# Altium project VENTUNOQ.PrjPcb (part 14 of 18)

## Sheet HEADERS_JMEDIA_JMISC.SchDoc: JMEDIA JMISC
size A3; Author: Silvio Navaretti; CompanyName: ARDUINO; DrawnBy: Silvio Navaretti; Engineer: Silvio Navaretti; Organization: ARDUINO; SheetNumber: 21; SheetTotal: 51; RevAuthor: Silvio Navaretti
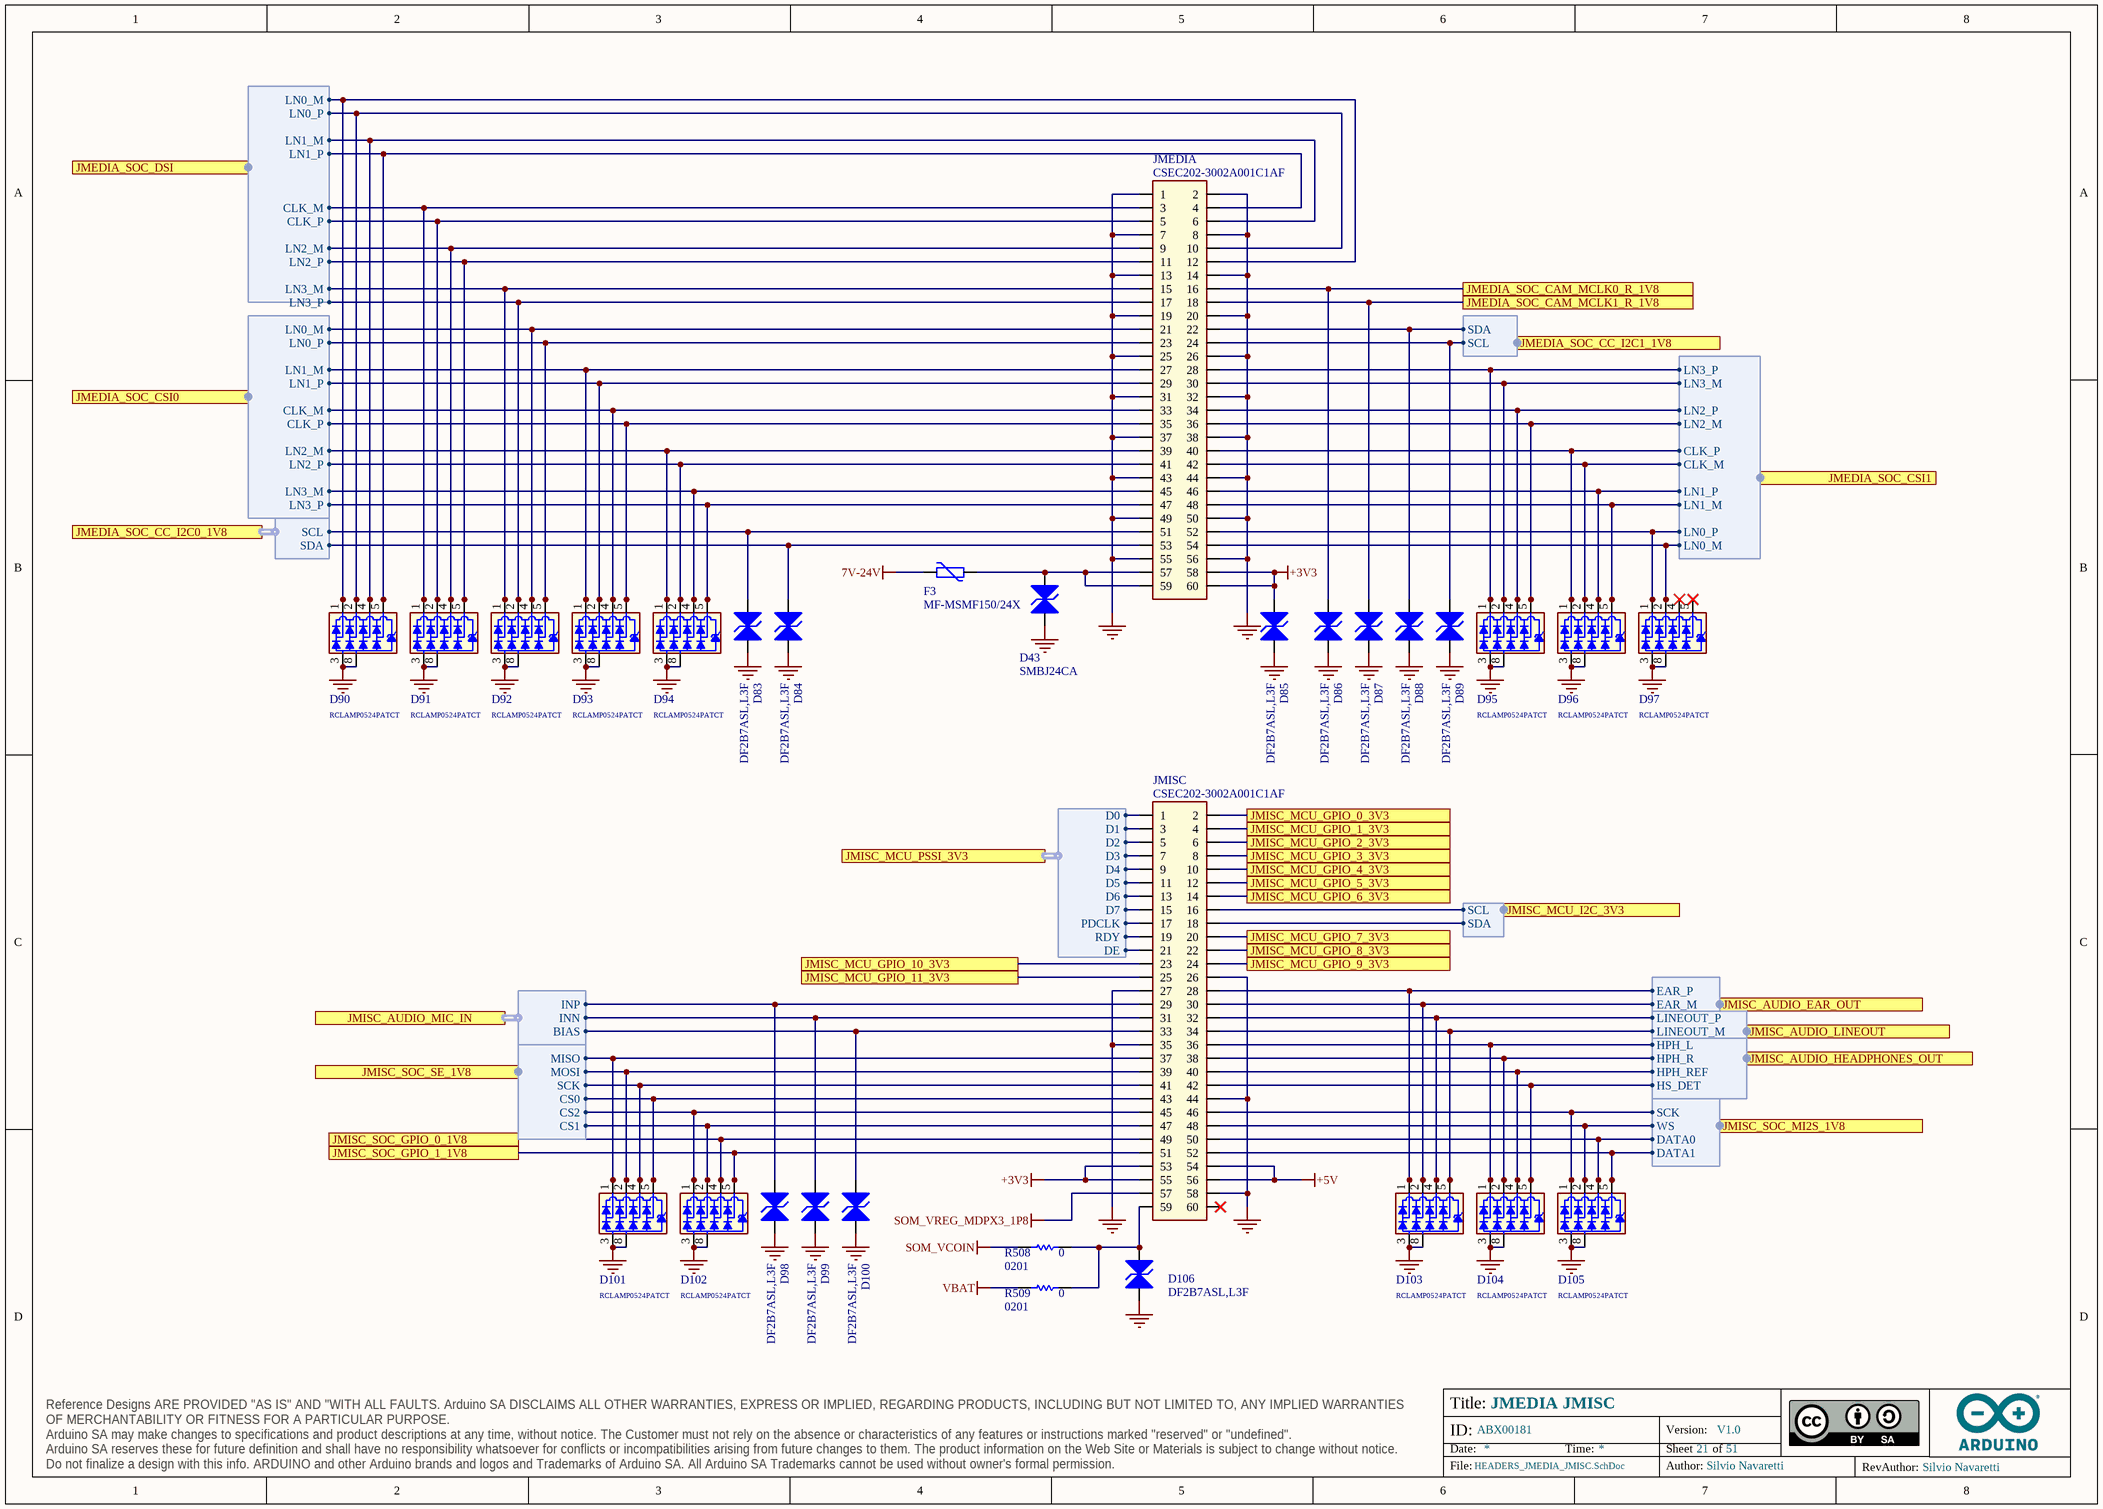
[diagram p43: HEADERS_JMEDIA_JMISC.SchDoc]

### Parts
D43  SMBJ24CA  [SMB_NOPOLARITY]
D83  DF2B7ASL,L3F  [DF2B7ASL,L3F]
D84  DF2B7ASL,L3F  [DF2B7ASL,L3F]
D85  DF2B7ASL,L3F  [DF2B7ASL,L3F]
D86  DF2B7ASL,L3F  [DF2B7ASL,L3F]
D87  DF2B7ASL,L3F  [DF2B7ASL,L3F]
D88  DF2B7ASL,L3F  [DF2B7ASL,L3F]
D89  DF2B7ASL,L3F  [DF2B7ASL,L3F]
D90  RCLAMP0524PATCT  [SLP2510P8]
D91  RCLAMP0524PATCT  [SLP2510P8]
D92  RCLAMP0524PATCT  [SLP2510P8]
D93  RCLAMP0524PATCT  [SLP2510P8]
D94  RCLAMP0524PATCT  [SLP2510P8]
D95  RCLAMP0524PATCT  [SLP2510P8]
D96  RCLAMP0524PATCT  [SLP2510P8]
D97  RCLAMP0524PATCT  [SLP2510P8]
D98  DF2B7ASL,L3F  [DF2B7ASL,L3F]
D99  DF2B7ASL,L3F  [DF2B7ASL,L3F]
D100  DF2B7ASL,L3F  [DF2B7ASL,L3F]
D101  RCLAMP0524PATCT  [SLP2510P8]
D102  RCLAMP0524PATCT  [SLP2510P8]
D103  RCLAMP0524PATCT  [SLP2510P8]
D104  RCLAMP0524PATCT  [SLP2510P8]
D105  RCLAMP0524PATCT  [SLP2510P8]
D106  DF2B7ASL,L3F  [DF2B7ASL,L3F]
F3  MF-MSMF150/24X  [1812]
JMEDIA  CSEC202-3002A001C1AF  [CSEC202-3002A001C1AF]
JMISC  CSEC202-3002A001C1AF  [CSEC202-3002A001C1AF]
R508  value 0  Case Code (Imperial): 0201  [RES-0201]  (hidden comment: CRCW02010000Z0ED)
R509  value 0  Case Code (Imperial): 0201  [RES-0201]  (hidden comment: CRCW02010000Z0ED)

### Ports
JMEDIA_SOC_CAM_MCLK0_R_1V8, JMEDIA_SOC_CAM_MCLK1_R_1V8, JMEDIA_SOC_CC_I2C0_1V8 (harness I2C), JMEDIA_SOC_CC_I2C1_1V8 (harness I2C), JMEDIA_SOC_CSI0 (harness MIPI_4LANES), JMEDIA_SOC_CSI1 (harness MIPI_4LANES), JMEDIA_SOC_DSI (harness MIPI_4LANES), JMISC_AUDIO_EAR_OUT (harness EAT), JMISC_AUDIO_HEADPHONES_OUT (harness HEADPHONES), JMISC_AUDIO_LINEOUT (harness LINEOUT), JMISC_AUDIO_MIC_IN (harness MIC), JMISC_MCU_GPIO_0_3V3, JMISC_MCU_GPIO_1_3V3, JMISC_MCU_GPIO_2_3V3, JMISC_MCU_GPIO_3_3V3, JMISC_MCU_GPIO_4_3V3, JMISC_MCU_GPIO_5_3V3, JMISC_MCU_GPIO_6_3V3, JMISC_MCU_GPIO_7_3V3, JMISC_MCU_GPIO_8_3V3, JMISC_MCU_GPIO_9_3V3, JMISC_MCU_GPIO_10_3V3, JMISC_MCU_GPIO_11_3V3, JMISC_MCU_I2C_3V3 (harness I2C), JMISC_MCU_PSSI_3V3 (harness PSSI), JMISC_SOC_GPIO_0_1V8, JMISC_SOC_GPIO_1_1V8, JMISC_SOC_MI2S_1V8 (harness SOM_MD_I2S), JMISC_SOC_SE_1V8 (harness SOM_MD_SPI_3CS)

### Harnesses
MIPI_4LANES: LN3_M, LN2_M, LN2_P, LN0_M, LN0_P, CLK_M, CLK_P, LN1_M, LN1_P, LN3_P
I2C: SDA, SCL
EAT: EAR_P, EAR_M
MIC: INP, INN, BIAS
LINEOUT: LINEOUT_P, LINEOUT_M
HEADPHONES: HPH_L, HPH_R, HPH_REF, HS_DET
SOM_MD_SPI_3CS: SCK, MISO, MOSI, CS0, CS1, CS2
SOM_MD_I2S: SCK, WS, DATA0, DATA1
PSSI: D0, D1, D2, D3, D4, D5, D6, D7, PDCLK, RDY, DE

### Nets
7V-24V: F3.1
+3V3: D85.2(A2) JMEDIA.58 JMEDIA.60 JMISC.53 JMISC.55
+5V: JMISC.54 JMISC.56
GND: D43.1(A1) D83.1(A1) D84.1(A1) D85.1(A1) D86.1(A1) D87.1(A1) D88.1(A1) D89.1(A1) D90.3 D90.8 D91.3 D91.8 D92.3 D92.8 D93.3 D93.8 D94.3 D94.8 D95.3 D95.8 D96.3 D96.8 D97.3 D97.8 D98.1(A1) D99.1(A1) D100.1(A1) D101.3 D101.8 D102.3 D102.8 D103.3 D103.8 D104.3 D104.8 D105.3 D105.8 D106.1(A1) JMEDIA.1 JMEDIA.2 JMEDIA.7 JMEDIA.8 JMEDIA.13 JMEDIA.14 JMEDIA.19 JMEDIA.20 JMEDIA.25 JMEDIA.26 JMEDIA.31 JMEDIA.32 JMEDIA.37 JMEDIA.38 JMEDIA.43 JMEDIA.44 JMEDIA.49 JMEDIA.50 JMEDIA.55 JMEDIA.56 JMISC.26 JMISC.27 JMISC.35 JMISC.44 JMISC.58
SOM_VCOIN: R508.2
SOM_VREG_MDPX3_1P8: JMISC.57
VBAT: R509.2
A_CLK_N: D91.1 D91.10 JMEDIA.3 ; port JMEDIA_SOC_DSI.CLK_M
A_CLK_N: D93.4 D93.7 JMEDIA.33 ; port JMEDIA_SOC_CSI0.CLK_M  [a separate net that carries the same name]
A_CLK_N: D96.2 D96.9 JMEDIA.42 ; port JMEDIA_SOC_CSI1.CLK_M  [a separate net that carries the same name]
A_CLK_P: D91.2 D91.9 JMEDIA.5 ; port JMEDIA_SOC_DSI.CLK_P
A_CLK_P: D93.5 D93.6 JMEDIA.35 ; port JMEDIA_SOC_CSI0.CLK_P  [a separate net that carries the same name]
A_CLK_P: D96.1 D96.10 JMEDIA.40 ; port JMEDIA_SOC_CSI1.CLK_P  [a separate net that carries the same name]
A_LN0_N: D90.1 D90.10 JMEDIA.12 ; port JMEDIA_SOC_DSI.LN0_M
A_LN0_N: D92.4 D92.7 JMEDIA.21 ; port JMEDIA_SOC_CSI0.LN0_M  [a separate net that carries the same name]
A_LN0_N: D97.2 D97.9 JMEDIA.54 ; port JMEDIA_SOC_CSI1.LN0_M  [a separate net that carries the same name]
A_LN0_P: D90.2 D90.9 JMEDIA.10 ; port JMEDIA_SOC_DSI.LN0_P
A_LN0_P: D92.5 D92.6 JMEDIA.23 ; port JMEDIA_SOC_CSI0.LN0_P  [a separate net that carries the same name]
A_LN0_P: D97.1 D97.10 JMEDIA.52 ; port JMEDIA_SOC_CSI1.LN0_P  [a separate net that carries the same name]
A_LN1_N: D90.4 D90.7 JMEDIA.6 ; port JMEDIA_SOC_DSI.LN1_M
A_LN1_N: D93.1 D93.10 JMEDIA.27 ; port JMEDIA_SOC_CSI0.LN1_M  [a separate net that carries the same name]
A_LN1_N: D96.5 D96.6 JMEDIA.48 ; port JMEDIA_SOC_CSI1.LN1_M  [a separate net that carries the same name]
A_LN1_P: D90.5 D90.6 JMEDIA.4 ; port JMEDIA_SOC_DSI.LN1_P
A_LN1_P: D93.2 D93.9 JMEDIA.29 ; port JMEDIA_SOC_CSI0.LN1_P  [a separate net that carries the same name]
A_LN1_P: D96.4 D96.7 JMEDIA.46 ; port JMEDIA_SOC_CSI1.LN1_P  [a separate net that carries the same name]
A_LN2_N: D91.4 D91.7 JMEDIA.9 ; port JMEDIA_SOC_DSI.LN2_M
A_LN2_N: D94.1 D94.10 JMEDIA.39 ; port JMEDIA_SOC_CSI0.LN2_M  [a separate net that carries the same name]
A_LN2_N: D95.5 D95.6 JMEDIA.36 ; port JMEDIA_SOC_CSI1.LN2_M  [a separate net that carries the same name]
A_LN2_P: D91.5 D91.6 JMEDIA.11 ; port JMEDIA_SOC_DSI.LN2_P
A_LN2_P: D94.2 D94.9 JMEDIA.41 ; port JMEDIA_SOC_CSI0.LN2_P  [a separate net that carries the same name]
A_LN2_P: D95.4 D95.7 JMEDIA.34 ; port JMEDIA_SOC_CSI1.LN2_P  [a separate net that carries the same name]
A_LN3_N: D92.1 D92.10 JMEDIA.15 ; port JMEDIA_SOC_DSI.LN3_M
A_LN3_N: D94.4 D94.7 JMEDIA.45 ; port JMEDIA_SOC_CSI0.LN3_M  [a separate net that carries the same name]
A_LN3_N: D95.2 D95.9 JMEDIA.30 ; port JMEDIA_SOC_CSI1.LN3_M  [a separate net that carries the same name]
A_LN3_P: D92.2 D92.9 JMEDIA.17 ; port JMEDIA_SOC_DSI.LN3_P
A_LN3_P: D94.5 D94.6 JMEDIA.47 ; port JMEDIA_SOC_CSI0.LN3_P  [a separate net that carries the same name]
A_LN3_P: D95.1 D95.10 JMEDIA.28 ; port JMEDIA_SOC_CSI1.LN3_P  [a separate net that carries the same name]
MD_CCI_I2C0.SCL: D83.2(A2) JMEDIA.51 ; port JMEDIA_SOC_CC_I2C0_1V8.SCL
MD_CCI_I2C0.SDA: D84.2(A2) JMEDIA.53 ; port JMEDIA_SOC_CC_I2C0_1V8.SDA
MD_CCI_I2C2.SCL: D89.2(A2) JMEDIA.24 ; port JMEDIA_SOC_CC_I2C1_1V8.SCL
MD_CCI_I2C2.SDA: D88.2(A2) JMEDIA.22 ; port JMEDIA_SOC_CC_I2C1_1V8.SDA
MD_GPIO_10: D101.1 D101.10 JMISC.37 ; port JMISC_SOC_SE_1V8.MISO
MD_GPIO_11: D101.2 D101.9 JMISC.39 ; port JMISC_SOC_SE_1V8.MOSI
MD_GPIO_12: D101.4 D101.7 JMISC.41 ; port JMISC_SOC_SE_1V8.SCK
MD_GPIO_13: D101.5 D101.6 JMISC.43 ; port JMISC_SOC_SE_1V8.CS0
MD_GPIO_14: D102.2 D102.9 JMISC.47 ; port JMISC_SOC_SE_1V8.CS1
MD_GPIO_15: D102.1 D102.10 JMISC.45 ; port JMISC_SOC_SE_1V8.CS2
MD_GPIO_67: D86.2(A2) JMEDIA.16 ; port JMEDIA_SOC_CAM_MCLK0_R_1V8
MD_GPIO_68: D87.2(A2) JMEDIA.18 ; port JMEDIA_SOC_CAM_MCLK1_R_1V8
MD_GPIO_73: D102.4 D102.7 JMISC.49 ; port JMISC_SOC_GPIO_0_1V8
MD_GPIO_74: D102.5 D102.6 JMISC.51 ; port JMISC_SOC_GPIO_1_1V8
MD_LPASS_GPIO_120: D105.1 D105.10 JMISC.46 ; port JMISC_SOC_MI2S_1V8.SCK
MD_LPASS_GPIO_121: D105.2 D105.9 JMISC.48 ; port JMISC_SOC_MI2S_1V8.WS
MD_LPASS_GPIO_122: D105.4 D105.7 JMISC.50 ; port JMISC_SOC_MI2S_1V8.DATA0
MD_LPASS_GPIO_123: D105.5 D105.6 JMISC.52 ; port JMISC_SOC_MI2S_1V8.DATA1
MIC_IN5_IN6.BIAS: D100.2(A2) JMISC.33 ; port JMISC_AUDIO_MIC_IN.BIAS
PA0: JMISC.20 ; port JMISC_MCU_GPIO_7_3V3
PA1: JMISC.22 ; port JMISC_MCU_GPIO_8_3V3
PA2: JMISC.24 ; port JMISC_MCU_GPIO_9_3V3
PA6: JMISC.17 ; port JMISC_MCU_PSSI_3V3.PDCLK
PA9: JMISC.1 ; port JMISC_MCU_PSSI_3V3.D0
PA11: JMISC.23 ; port JMISC_MCU_GPIO_10_3V3
PA12: JMISC.25 ; port JMISC_MCU_GPIO_11_3V3
PC7: JMISC.3 ; port JMISC_MCU_PSSI_3V3.D1
PC8: JMISC.5 ; port JMISC_MCU_PSSI_3V3.D2
PC11: JMISC.9 ; port JMISC_MCU_PSSI_3V3.D4
PD3: JMISC.11 ; port JMISC_MCU_PSSI_3V3.D5
PE1: JMISC.7 ; port JMISC_MCU_PSSI_3V3.D3
PE2: JMISC.2 ; port JMISC_MCU_GPIO_0_3V3
PE3: JMISC.4 ; port JMISC_MCU_GPIO_1_3V3
PE4: JMISC.6 ; port JMISC_MCU_GPIO_2_3V3
PE5: JMISC.8 ; port JMISC_MCU_GPIO_3_3V3
PE6: JMISC.10 ; port JMISC_MCU_GPIO_4_3V3
PE7: JMISC.12 ; port JMISC_MCU_GPIO_5_3V3
PE8: JMISC.14 ; port JMISC_MCU_GPIO_6_3V3
PF0: JMISC.18 ; port JMISC_MCU_I2C_3V3.SDA
PF1: JMISC.16 ; port JMISC_MCU_I2C_3V3.SCL
PF4: JMISC.13 ; port JMISC_MCU_PSSI_3V3.D6
PH8: JMISC.21 ; port JMISC_MCU_PSSI_3V3.DE
PI5: JMISC.19 ; port JMISC_MCU_PSSI_3V3.RDY
PI7: JMISC.15 ; port JMISC_MCU_PSSI_3V3.D7
NetC209_2: D98.2(A2) JMISC.29 ; port JMISC_AUDIO_MIC_IN.INP
NetC217_2: D99.2(A2) JMISC.31 ; port JMISC_AUDIO_MIC_IN.INN
NetC248_2: D104.1 D104.10 JMISC.36 ; port JMISC_AUDIO_HEADPHONES_OUT.HPH_L
NetC295_2: D104.2 D104.9 JMISC.38 ; port JMISC_AUDIO_HEADPHONES_OUT.HPH_R
NetD43_2: D43.2(A2) F3.2 JMEDIA.57 JMEDIA.59
NetD97_4: D97.4 D97.7
NetD97_5: D97.5 D97.6
NetD103_1: D103.1 D103.10 JMISC.28 ; port JMISC_AUDIO_EAR_OUT.EAR_P
NetD103_2: D103.2 D103.9 JMISC.30 ; port JMISC_AUDIO_EAR_OUT.EAR_M
NetD103_4: D103.4 D103.7 JMISC.32 ; port JMISC_AUDIO_LINEOUT.LINEOUT_P
NetD103_5: D103.5 D103.6 JMISC.34 ; port JMISC_AUDIO_LINEOUT.LINEOUT_M
NetD104_4: D104.4 D104.7 JMISC.40 ; port JMISC_AUDIO_HEADPHONES_OUT.HPH_REF
NetD104_5: D104.5 D104.6 JMISC.42 ; port JMISC_AUDIO_HEADPHONES_OUT.HS_DET
NetD106_2: D106.2(A2) JMISC.59 R508.1 R509.1

Not connected (* = marked no-connect by the designer): JMISC 60*

### Notes on the sheet
- Title:
- ID:
- Date:
- Time:
- Version:
- Sheet
- of
- RevAuthor:
- Reference Designs ARE PROVIDED "AS IS" AND "WITH ALL FAULTS. Arduino SA DISCLAIMS ALL OTHER WARRANTIES, EXPRESS OR IMPLIED, REGARDING PRODUCTS, INCLUDING BUT NOT LIMITED TO, ANY IMPLIED WARRANTIES OF MERCHANTABILITY OR FITNESS FOR A PARTICULAR PURPOSE.
  Arduino SA may make changes to specifications and product descriptions at any time, without notice. The Customer must not rely on the absence or characteristics of any features or instructions marked "reserved" or "undefined".
  Arduino SA reserves these for future definition and shall have no responsibility whatsoever for conflicts or incompatibilities arising from future changes to them. The product information on the Web Site or Materials is subject to change without notice.
  Do not finalize a design with this info. ARDUINO and other Arduino brands and logos and Trademarks of Arduino SA. All Arduino SA Trademarks cannot be used without owner's formal permission.
- File:
- Author:

### Library data of the parts
D43 = D0070-A.2: TVS BIDIRECTIONAL SMD Vr 24V, Vbr min 26.7V, 600W, SMB; Manufacturer: Littlefuse; V(BR) Typ (V): 26.7; Code Arduino: D0070; Manufacturer 2: Bourns; Part Number: SMBJ24CA; Manufacturer 3: Hottech
D83-D89 D98-D100 D106 = D0099-5: TVS BIDIRECTIONAL SMD Vr 5.5V, Vbr min 5.8V, 0.62x0.32mm; Manufacturer: TOSHIBA; Vforward max: 0V; Ireverse max: 1µA; Power max: 80W; Code Arduino: D0099; Vreverse max: 20V; V(BR) min: 5.8V; V(RWM) max: 5.5V; Part Number: DF2B7ASL,L3F
D90-D97 D101-D105 = D0097-A.6: TVS UNIDIRECTIONAL 4CH 0.8pF 5V SLP2510P8 10-pin 2.5x1.0x0.58mm; Manufacturer: SEMTECH; Code Arduino: D0097; Device Type: ESD protection; Part Number: RCLAMP0524PATCT
F3 = P0019-A.1: PTC Ihold 1.5A Itrip 3A 24V 1812; Manufacturer: Bourns; Code Arduino: P0019; Part Number: MF-MSMF150/24X
JMEDIA JMISC = J0565-A.3: CONN HEADER FEMALE VERTICAL SMD 1.27mm 2x30 POS heigth 4.4mm; Manufacturer: Greenconn; Code Arduino: J0565; Part Number: CSEC202-3002A001C1AF
R508 R509 = R0140-A.21: RES CHIP 0201 0R; Manufacturer: Vishay; Temperature coefficient: 0ppm; Code Arduino: R0140; Power: 50mW; Tolerance: 0%; Technology: Thick film; Part Number: CRCW02010000Z0ED

## Sheet HEADERS_JCTL.SchDoc: JCTL
size A3; Author: Silvio Navaretti; CompanyName: ARDUINO; DrawnBy: Silvio Navaretti; Engineer: Silvio Navaretti; Organization: ARDUINO; SheetNumber: 23; SheetTotal: 51; RevAuthor: Silvio Navaretti
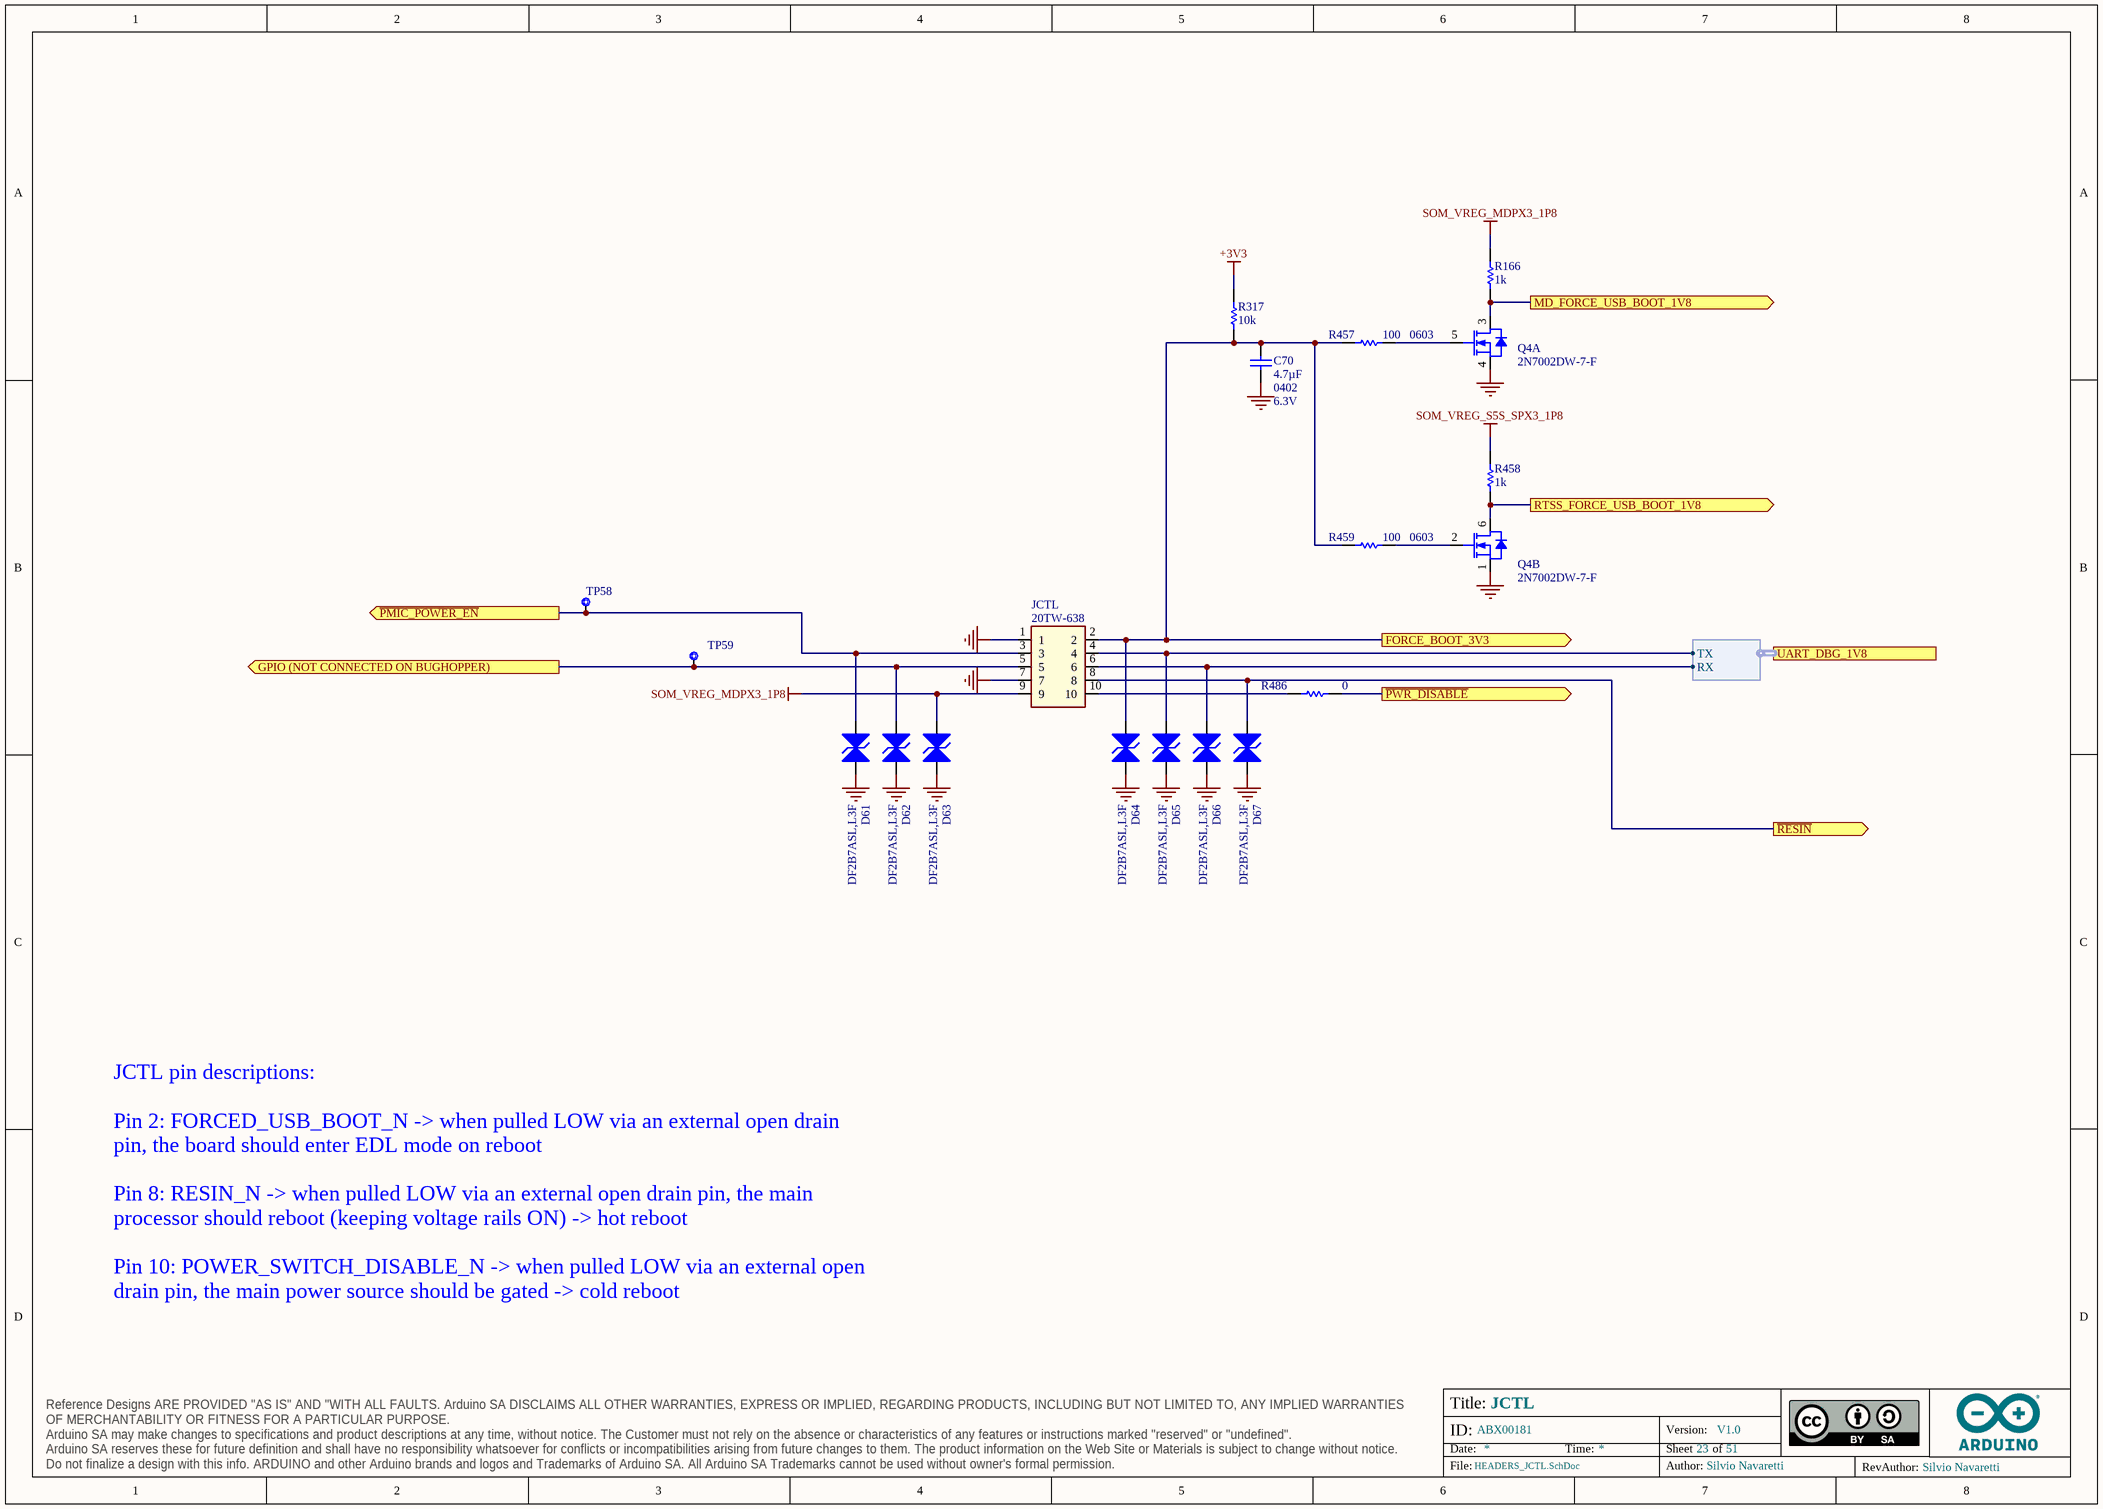
[diagram p44: HEADERS_JCTL.SchDoc]

### Parts
C70  value 4.7µF  Case Code (Imperial): 0402  Voltage: 6.3V  [CAP-0402]  (hidden comment: C1005A475M6R3NT)
D61  DF2B7ASL,L3F  [DF2B7ASL,L3F]
D62  DF2B7ASL,L3F  [DF2B7ASL,L3F]
D63  DF2B7ASL,L3F  [DF2B7ASL,L3F]
D64  DF2B7ASL,L3F  [DF2B7ASL,L3F]
D65  DF2B7ASL,L3F  [DF2B7ASL,L3F]
D66  DF2B7ASL,L3F  [DF2B7ASL,L3F]
D67  DF2B7ASL,L3F  [DF2B7ASL,L3F]
JCTL  20TW-638  [20TW-638]
Q4  2N7002DW-7-F  [SOT363]  (parts A,B of 2)
R166  value 1k  [RES-0201]  (hidden comment: RC0201FR-071KL)
R317  value 10k  [RES-0201]  (hidden comment: RC0201FR-0710KL)
R457  value 100  Case Code (Imperial): 0603  [RES-0603]  (hidden comment: CRCW0603100RFKEAC)
R458  value 1k  [RES-0201]  (hidden comment: RC0201FR-071KL)
R459  value 100  Case Code (Imperial): 0603  [RES-0603]  (hidden comment: CRCW0603100RFKEAC)
R486  value 0  [RES-0201]  (hidden comment: CRCW02010000Z0ED)
TP58  Test point 1.00mm  [TP-1.00MM]  (value not drawn)  (no BOM)
TP59  Test point 1.00mm  [TP-1.00MM]  (value not drawn)  (no BOM)

### Ports
FORCE_BOOT_3V3 (out), GPIO (NOT CONNECTED ON BUGHOPPER) (out), MD_FORCE_USB_BOOT_1V8 (out), RTSS_FORCE_USB_BOOT_1V8 (out), UART_DBG_1V8 (harness UART), ~{PMIC_POWER_EN} (out), ~{PWR_DISABLE} (out), ~{RESIN} (out)

### Harnesses
UART: TX, RX

### Nets
+3V3: R317.2
GND: C70.2 D61.1(A1) D62.1(A1) D63.1(A1) D64.1(A1) D65.1(A1) D66.1(A1) D67.1(A1) JCTL.1 JCTL.7 Q4.1(S) Q4.4(S)
SOM_VREG_MDPX3_1P8: D63.2(A2) JCTL.9 R166.1
SOM_VREG_S5S_SPX3_1P8: R458.1
FORCE_BOOT_3V3: C70.1 D64.2(A2) JCTL.2 R317.1 R457.2 R459.2 ; port FORCE_BOOT_3V3
MD_GPIO_43: D65.2(A2) JCTL.4 ; port UART_DBG_1V8.TX
MD_GPIO_44: D66.2(A2) JCTL.6 ; port UART_DBG_1V8.RX
~{PM_RESIN_N_3V3}: D67.2(A2) JCTL.8 ; port ~{RESIN}
~{POWER_DISABLE_7-24V}: R486.1 ; port ~{PWR_DISABLE}
NetD61_2: D61.2(A2) JCTL.3 TP58.X ; port ~{PMIC_POWER_EN}
NetD62_2: D62.2(A2) JCTL.5 TP59.X ; port GPIO (NOT CONNECTED ON BUGHOPPER)
NetJCTL_10: JCTL.10 R486.2
NetQ4_2: Q4.2(G) R459.1
NetQ4_3: Q4.3(D) R166.2 ; port MD_FORCE_USB_BOOT_1V8
NetQ4_5: Q4.5(G) R457.1
NetQ4_6: Q4.6(D) R458.2 ; port RTSS_FORCE_USB_BOOT_1V8

### Notes on the sheet
- JCTL pin descriptions:
  Pin 2: FORCED_USB_BOOT_N -> when pulled LOW via an external open drain pin, the board should enter EDL mode on reboot
  Pin 8: RESIN_N -> when pulled LOW via an external open drain pin, the main processor should reboot (keeping voltage rails ON) -> hot reboot
  Pin 10: POWER_SWITCH_DISABLE_N -> when pulled LOW via an external open drain pin, the main power source should be gated -> cold reboot
- Title:
- ID:
- Date:
- Time:
- Version:
- Sheet
- of
- RevAuthor:
- Reference Designs ARE PROVIDED "AS IS" AND "WITH ALL FAULTS. Arduino SA DISCLAIMS ALL OTHER WARRANTIES, EXPRESS OR IMPLIED, REGARDING PRODUCTS, INCLUDING BUT NOT LIMITED TO, ANY IMPLIED WARRANTIES OF MERCHANTABILITY OR FITNESS FOR A PARTICULAR PURPOSE.
  Arduino SA may make changes to specifications and product descriptions at any time, without notice. The Customer must not rely on the absence or characteristics of any features or instructions marked "reserved" or "undefined".
  Arduino SA reserves these for future definition and shall have no responsibility whatsoever for conflicts or incompatibilities arising from future changes to them. The product information on the Web Site or Materials is subject to change without notice.
  Do not finalize a design with this info. ARDUINO and other Arduino brands and logos and Trademarks of Arduino SA. All Arduino SA Trademarks cannot be used without owner's formal permission.
- File:
- Author:

### Library data of the parts
C70 = C0037-A.14: CAP CHIP 0402 4.7uF 20% 6V3 X5R; Manufacturer: Hottech; Code Arduino: 0833; Dielectric: X5R; Technology: Ceramic; Part Number: C1005A475M6R3NT; Manufacturer 2: Samsung Electro-Mechanics; Tolerance: 20%; Manufacturer 3: Murata Electronics; Part number 3: GRM155R60J475ME47D; Part number 2: CL05A475KQ5NRNC
D61-D67 = D0099-5: as D83-D89 on sheet HEADERS_JMEDIA_JMISC; V(BR) min: 5.8V; V(RWM) max: 5.5V; Part Number: DF2B7ASL,L3F
JCTL = J0570-A.1: CONN HEADER MALE 10POS 2x5 2.54mm SMD; Manufacturer: 4UCONN; Number of Contacts: 10; Connector Type: BOARD CONNECTOR; Code Arduino: J0570; Contact Material: Gold; Part Number: 20TW-638; Termination: SMD/SMT; Insulation Color: Black
Q4 = T0011-A.12: MOSFET 2N-CH 60V 0.32A SOT363; Manufacturer: Diodes Inc.; Device Type: Mosfet 2N-CH SMD; Code Arduino: A5500; Manufacturer 2: Nexperia; Manufacturer Part Number 2: 2N7002PS,115; Pin Count: 6; Part Number: 2N7002DW-7-F
R166 R458 = R0195-A.22: RES CHIP 0201 1k 1% 1/20W; Manufacturer: Yageo; Power: 50mW; Temperature coefficient: 200ppm; Code Arduino: R0195; Tolerance: 1%; Case Code (Imperial): 0201; Part Number: RC0201FR-071KL; Technology: Thick film
R317 = R0145-A.21: RES CHIP 0201 10k 1% 1/20W; Manufacturer: Yageo; Power: 50mW; Temperature coefficient: 200ppm; Code Arduino: R0145; Manufacturer 2: Samsung Electro-Mechanics; Tolerance: 1%; Case Code (Imperial): 0201; Part Number: RC0201FR-0710KL; Technology: Thick film
R457 R459 = R0105-A.22: RES CHIP 0603 100R 1% 1/10W; Manufacturer: Vishay; Power: 100mW; Temperature coefficient: 100ppm; Code Arduino: A5099; Part Number: CRCW0603100RFKEAC; Tolerance: 1%; Technology: Thick film
R486 = R0140-A.21: as R508 on sheet HEADERS_JMEDIA_JMISC; Technology: Thick film; Case Code (Imperial): 0201; Part Number: CRCW02010000Z0ED
TP58 TP59 = UT0013-A.6: Part Number: This is not a component; Design Item ID: CMP-018-0005-A.3; Source: ut.SchLib; Manufacturer: This is not a component; Code Arduino: This is not a component; Pin Count: 1

## Sheet HEATSINK_FAN.SchDoc: HEATSINK FAN
size A3; Author: Silvio Navaretti; CompanyName: ARDUINO; DrawnBy: Silvio Navaretti; Engineer: Silvio Navaretti; Organization: ARDUINO; SheetNumber: 50; SheetTotal: 51; RevAuthor: Silvio Navaretti
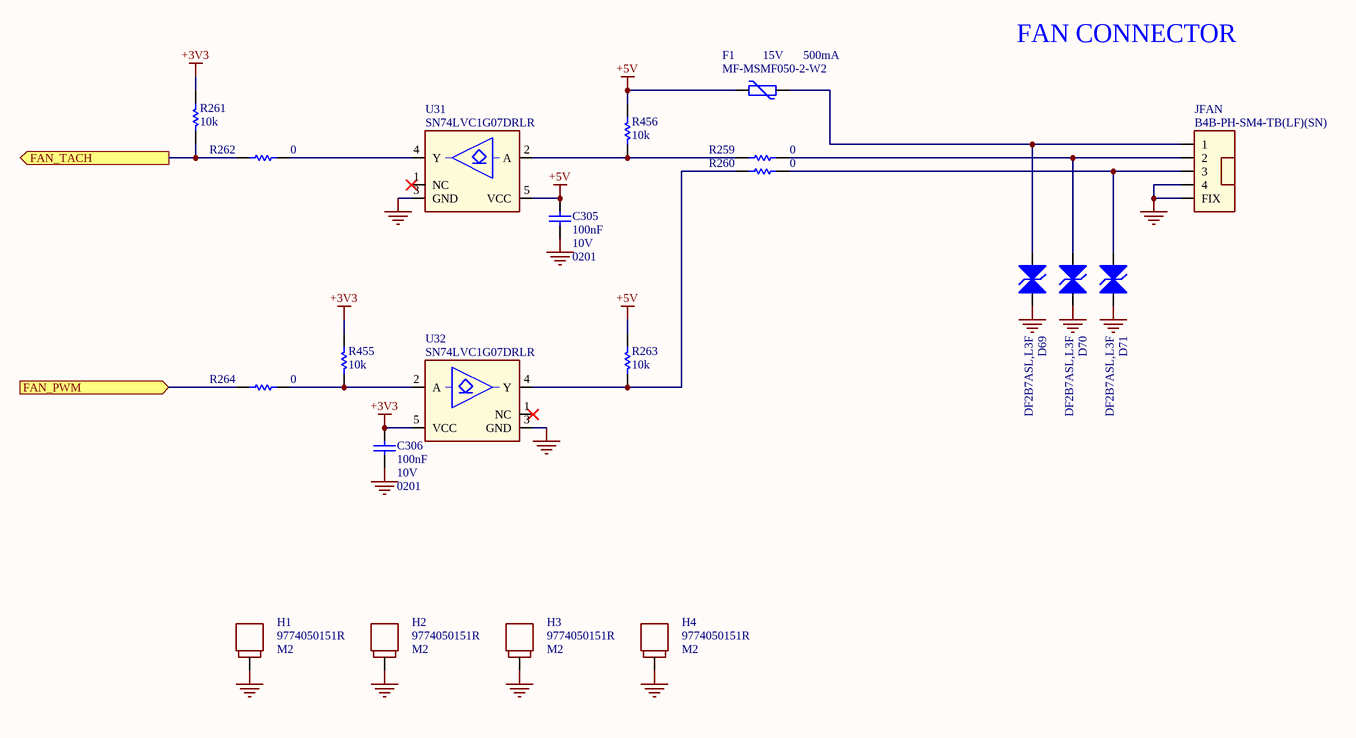
[diagram p45: HEATSINK_FAN.SchDoc]

### Parts
C305  value 100nF  Voltage: 10V  Case Code (Imperial): 0201  [CAP-0201]  (hidden comment: CL03A104KP3NNNC)
C306  value 100nF  Voltage: 10V  Case Code (Imperial): 0201  [CAP-0201]  (hidden comment: CL03A104KP3NNNC)
D69  DF2B7ASL,L3F  [DF2B7ASL,L3F]
D70  DF2B7ASL,L3F  [DF2B7ASL,L3F]
D71  DF2B7ASL,L3F  [DF2B7ASL,L3F]
F1  MF-MSMF050-2-W2  Hold Current: 500mA  Operating Supply Voltage: 15V  [1812]
H1  9774050151R  [9774050151R]
H2  9774050151R  [9774050151R]
H3  9774050151R  [9774050151R]
H4  9774050151R  [9774050151R]
JFAN  B4B-PH-SM4-TB(LF)(SN)  [B4B-PH-SM4-TB(LF)(SN)]
R259  value 0  [RES-0201]  (hidden comment: CRCW02010000Z0ED)
R260  value 0  [RES-0201]  (hidden comment: CRCW02010000Z0ED)
R261  value 10k  [RES-0201]  (hidden comment: RC0201FR-0710KL)
R262  value 0  [RES-0201]  (hidden comment: CRCW02010000Z0ED)
R263  value 10k  [RES-0201]  (hidden comment: RC0201FR-0710KL)
R264  value 0  [RES-0201]  (hidden comment: CRCW02010000Z0ED)
R455  value 10k  [RES-0201]  (hidden comment: RC0201FR-0710KL)
R456  value 10k  [RES-0201]  (hidden comment: RC0201FR-0710KL)
U31  SN74LVC1G07DRLR  [TI DRL DRL0005A]
U32  SN74LVC1G07DRLR  [TI DRL DRL0005A]

### Ports
FAN_PWM (in), FAN_TACH (out)

### Nets
+3V3: C306.2 R261.2 R455.2 U32.5(VCC)
+5V: C305.2 F1.1 R263.2 R456.2 U31.5(VCC)
GND: C305.1 C306.1 D69.1(A1) D70.1(A1) D71.1(A1) H1.1 H2.1 H3.1 H4.1 JFAN.4 JFAN.FIX U31.3(GND) U32.3(GND)
PA7: R261.1 R262.2 ; port FAN_TACH
PG15: R264.2 ; port FAN_PWM
NetD69_2: D69.2(A2) F1.2 JFAN.1
NetD70_2: D70.2(A2) JFAN.2 R259.1
NetD71_2: D71.2(A2) JFAN.3 R260.1
NetR259_2: R259.2 R456.1 U31.2(A)
NetR260_2: R260.2 R263.1 U32.4(Y)
NetR262_1: R262.1 U31.4(Y)
NetR264_1: R264.1 R455.1 U32.2(A)

Not connected (* = marked no-connect by the designer): U31 1(NC)*; U32 1(NC)*

### Notes on the sheet
- FAN CONNECTOR
- Title:
- ID:
- Date:
- Time:
- Version:
- Sheet
- of
- RevAuthor:
- Reference Designs ARE PROVIDED "AS IS" AND "WITH ALL FAULTS. Arduino SA DISCLAIMS ALL OTHER WARRANTIES, EXPRESS OR IMPLIED, REGARDING PRODUCTS, INCLUDING BUT NOT LIMITED TO, ANY IMPLIED WARRANTIES OF MERCHANTABILITY OR FITNESS FOR A PARTICULAR PURPOSE.
  Arduino SA may make changes to specifications and product descriptions at any time, without notice. The Customer must not rely on the absence or characteristics of any features or instructions marked "reserved" or "undefined".
  Arduino SA reserves these for future definition and shall have no responsibility whatsoever for conflicts or incompatibilities arising from future changes to them. The product information on the Web Site or Materials is subject to change without notice.
  Do not finalize a design with this info. ARDUINO and other Arduino brands and logos and Trademarks of Arduino SA. All Arduino SA Trademarks cannot be used without owner's formal permission.
- File:
- Author:
- (in symbol S0005-A.6) M2

### Library data of the parts
C305 C306 = C0113-A.6: CAP CHIP 0201 100nF 10% 10V X5R; Manufacturer: Samsung Electro-Mechanics; Code Arduino: C0113; Technology: Ceramic; Part Number: CL03A104KP3NNNC; Dielectric: X5R; Tolerance: 10%
D69-D71 = D0099-5: as D83-D89 on sheet HEADERS_JMEDIA_JMISC; V(BR) min: 5.8V; V(RWM) max: 5.5V; Part Number: DF2B7ASL,L3F
F1 = P0002-A.7: PTC RESET FUSE 15V 500MA 1812 LOGO OO ARDUINO; Manufacturer: Bourns; Approvals: UL,CSA,TUV; Time to Trip: 0.15s; Max Current Rating: 100A; Trip Current: 1A; Resistance: 150mR; Code Arduino: 3335; Power Dissipation: 800mW; Part Number: MF-MSMF050-2-W2; Contact Plating: Gold; Case Code (Metric): 4532; Min Operating Temperature: -40°C; Packaging: Tape and Reel; Max Operating Temperature: 85°C; Radiation Hardening: No; Voltage Rating (DC): 15V; Termination: SMD/SMT; Number of Terminals: 2; Terminal Material: Gold; Voltage Rating: 15V; Width: 3.41mm; Case Code (Imperial): 1812; Length: 4.73mm; Current Rating: 100A; REACH SVHC: No SVHC; Package Quantity: 2000; Lead Free: Lead Free; Case/Package: 1812; Height: 0.85mm; Mount: Surface Mount,PCB
H1-H4 = S0005-A.6: M2.5 SPACER SMT ROUND STEEL H=5mm; Manufacturer: Würth Elektronik; Code Arduino: S0005; Part Number: 9774050151R
JFAN = J0557-A.2: CONN Header SMD 1x4 vertical polarized; Manufacturer: JST; Code Arduino: J0557; Part Number: B4B-PH-SM4-TB(LF)(SN)
R259 R260 R262 R264 = R0140-A.21: as R508 on sheet HEADERS_JMEDIA_JMISC; Technology: Thick film; Case Code (Imperial): 0201; Part Number: CRCW02010000Z0ED
R261 R263 R455 R456 = R0145-A.21: as R317 on sheet HEADERS_JCTL; Manufacturer 2: Samsung Electro-Mechanics; Tolerance: 1%; Case Code (Imperial): 0201; Part Number: RC0201FR-0710KL; Technology: Thick film
U31 U32 = U0494-A.2: IC buffer open drain, 1.65V to 5.5V, 32mA sink current, SOT-5X3 1.6mmx1.6mm; Manufacturer: Texas Instruments; Code Arduino: U0494; Part Number: SN74LVC1G07DRLR

## Sheet PCIE.SchDoc: PCIE
size A3; Author: Silvio Navaretti; CompanyName: ARDUINO; Organization: ARDUINO; SheetNumber: 24; SheetTotal: 51; RevAuthor: Silvio Navaretti
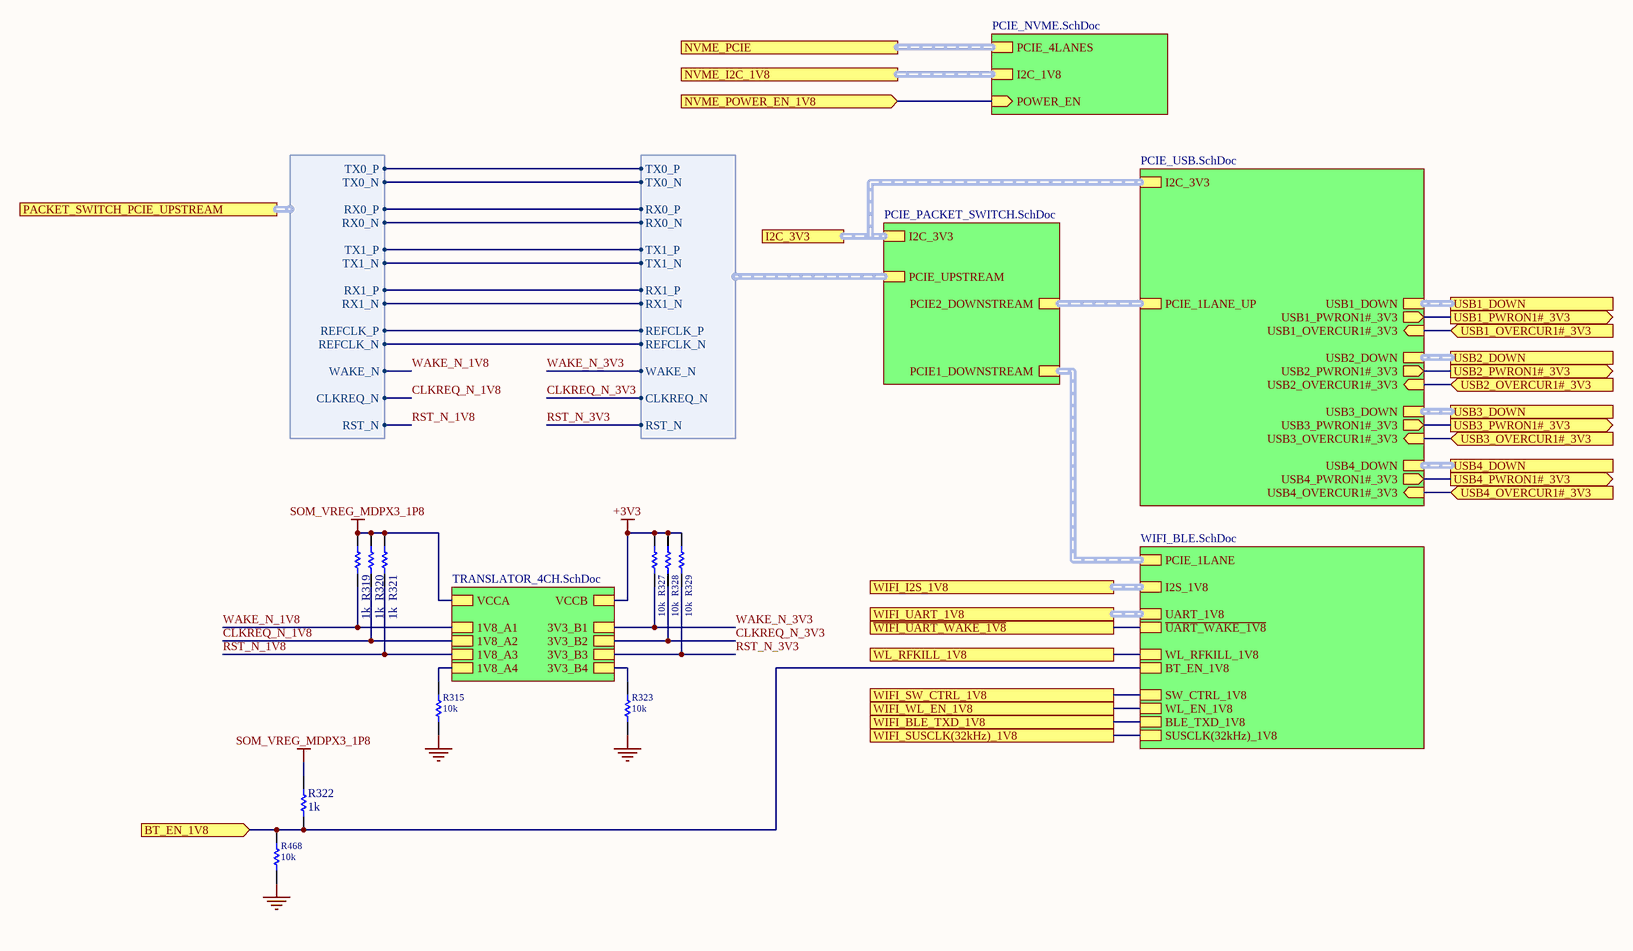
[diagram p46: PCIE.SchDoc]

### Parts
R315  value 10k  [RES-0201]  (hidden comment: RC0201FR-0710KL)
R319  value 1k  [RES-0201]  (hidden comment: RC0201FR-071KL)
R320  value 1k  [RES-0201]  (hidden comment: RC0201FR-071KL)
R321  value 1k  [RES-0201]  (hidden comment: RC0201FR-071KL)
R322  value 1k  [RES-0201]  (hidden comment: RC0201FR-071KL)
R323  value 10k  [RES-0201]  (hidden comment: RC0201FR-0710KL)
R327  value 10k  [RES-0201]  (hidden comment: RC0201FR-0710KL)
R328  value 10k  [RES-0201]  (hidden comment: RC0201FR-0710KL)
R329  value 10k  [RES-0201]  (hidden comment: RC0201FR-0710KL)
R468  value 10k  [RES-0201]  (hidden comment: RC0201FR-0710KL)

### Sub-sheets
U_PCIE_NVME = PCIE_NVME.SchDoc: POWER_EN (in), PCIE_4LANES (harness SOM_MD_PCIE1), I2C_1V8 (harness I2C)
U_PCIE_PACKET_SWITCH = PCIE_PACKET_SWITCH.SchDoc: PCIE_UPSTREAM (harness SOM_MD_PCIE0), I2C_3V3 (harness I2C), PCIE1_DOWNSTREAM (harness PCIE_1LANE), PCIE2_DOWNSTREAM (harness PCIE_1LANE)
U_PCIE_USB = PCIE_USB.SchDoc: USB1_DOWN (harness SOM_MD_USB0), USB1_PWRON1#_3V3 (out), USB1_OVERCUR1#_3V3 (in), USB2_DOWN (harness SOM_MD_USB0), USB2_PWRON1#_3V3 (out), USB2_OVERCUR1#_3V3 (in), USB3_DOWN (harness SOM_MD_USB0), USB3_PWRON1#_3V3 (out), USB3_OVERCUR1#_3V3 (in), USB4_DOWN (harness SOM_MD_USB0), USB4_PWRON1#_3V3 (out), USB4_OVERCUR1#_3V3 (in), PCIE_1LANE_UP (harness PCIE_1LANE), I2C_3V3 (harness I2C)
U_TRANSLATOR_4CH = TRANSLATOR_4CH.SchDoc: 1V8_A1, 1V8_A2, 1V8_A3, 1V8_A4, 3V3_B1, 3V3_B2, 3V3_B3, 3V3_B4, VCCA, VCCB
U_WIFI_BLE = WIFI_BLE.SchDoc: PCIE_1LANE (harness PCIE_1LANE), I2S_1V8 (harness SOM_MD_I2S), WL_RFKILL_1V8, UART_1V8 (harness SOM_MD_UART_FLCRTL), ~{UART_WAKE_1V8}, SW_CTRL_1V8, WL_EN_1V8, BLE_TXD_1V8, SUSCLK(32kHz)_1V8, BT_EN_1V8

### Ports
BT_EN_1V8 (in), I2C_3V3, NVME_I2C_1V8, NVME_PCIE, NVME_POWER_EN_1V8 (in), PACKET_SWITCH_PCIE_UPSTREAM (harness SOM_MD_PCIE0), USB1_DOWN, USB1_OVERCUR1#_3V3 (in), USB1_PWRON1#_3V3 (out), USB2_DOWN, USB2_OVERCUR1#_3V3 (in), USB2_PWRON1#_3V3 (out), USB3_DOWN (harness SOM_MD_USB0), USB3_OVERCUR1#_3V3 (in), USB3_PWRON1#_3V3 (out), USB4_DOWN, USB4_OVERCUR1#_3V3 (in), USB4_PWRON1#_3V3 (out), WIFI_BLE_TXD_1V8, WIFI_I2S_1V8, WIFI_SUSCLK(32kHz)_1V8, WIFI_SW_CTRL_1V8, WIFI_UART_1V8, WIFI_WL_EN_1V8, WL_RFKILL_1V8, ~{WIFI_UART_WAKE_1V8}

### Harnesses
SOM_MD_PCIE0: RX0_N, RX0_P, TX0_P, TX0_N, RX1_N, RX1_P, TX1_P, TX1_N, REFCLK_N, REFCLK_P, WAKE_N, CLKREQ_N, RST_N

### Nets
+3V3: R327.1 R328.1 R329.1 ; sheet U_TRANSLATOR_4CH/VCCB
GND: R315.1 R323.1 R468.1
SOM_VREG_MDPX3_1P8: R319.1 R320.1 R321.1 R322.2 ; sheet U_TRANSLATOR_4CH/VCCA
CLKREQ_N_1V8: R320.2 ; sheet U_TRANSLATOR_4CH/1V8_A2, port PACKET_SWITCH_PCIE_UPSTREAM.CLKREQ_N
CLKREQ_N_3V3: R328.2 ; sheet U_TRANSLATOR_4CH/3V3_B2, sheet U_PCIE_PACKET_SWITCH/PCIE_UPSTREAM.CLKREQ_N
MD_GPIO_51: port NVME_POWER_EN_1V8, sheet U_PCIE_NVME/POWER_EN
MD_GPIO_54: port WL_RFKILL_1V8, sheet U_WIFI_BLE/WL_RFKILL_1V8
MD_GPIO_55: R322.1 R468.2 ; port BT_EN_1V8, sheet U_WIFI_BLE/BT_EN_1V8
MD_GPIO_56: port WIFI_WL_EN_1V8, sheet U_WIFI_BLE/WL_EN_1V8
MD_GPIO_65: port ~{WIFI_UART_WAKE_1V8}, sheet U_WIFI_BLE/~{UART_WAKE_1V8}
MD_GPIO_100: port WIFI_SW_CTRL_1V8, sheet U_WIFI_BLE/SW_CTRL_1V8
MD_GPIO_101: port WIFI_BLE_TXD_1V8, sheet U_WIFI_BLE/BLE_TXD_1V8
MD_PCIE0_2LANES.REFCLK_N: port PACKET_SWITCH_PCIE_UPSTREAM.REFCLK_N, sheet U_PCIE_PACKET_SWITCH/PCIE_UPSTREAM.REFCLK_N
MD_PCIE0_2LANES.REFCLK_P: port PACKET_SWITCH_PCIE_UPSTREAM.REFCLK_P, sheet U_PCIE_PACKET_SWITCH/PCIE_UPSTREAM.REFCLK_P
MD_PCIE0_2LANES.RX0_N: port PACKET_SWITCH_PCIE_UPSTREAM.RX0_N, sheet U_PCIE_PACKET_SWITCH/PCIE_UPSTREAM.RX0_N
MD_PCIE0_2LANES.RX0_P: port PACKET_SWITCH_PCIE_UPSTREAM.RX0_P, sheet U_PCIE_PACKET_SWITCH/PCIE_UPSTREAM.RX0_P
MD_PCIE0_2LANES.RX1_N: port PACKET_SWITCH_PCIE_UPSTREAM.RX1_N, sheet U_PCIE_PACKET_SWITCH/PCIE_UPSTREAM.RX1_N
MD_PCIE0_2LANES.RX1_P: port PACKET_SWITCH_PCIE_UPSTREAM.RX1_P, sheet U_PCIE_PACKET_SWITCH/PCIE_UPSTREAM.RX1_P
MD_PCIE0_2LANES.TX0_N: port PACKET_SWITCH_PCIE_UPSTREAM.TX0_N, sheet U_PCIE_PACKET_SWITCH/PCIE_UPSTREAM.TX0_N
MD_PCIE0_2LANES.TX0_P: port PACKET_SWITCH_PCIE_UPSTREAM.TX0_P, sheet U_PCIE_PACKET_SWITCH/PCIE_UPSTREAM.TX0_P
MD_PCIE0_2LANES.TX1_N: port PACKET_SWITCH_PCIE_UPSTREAM.TX1_N, sheet U_PCIE_PACKET_SWITCH/PCIE_UPSTREAM.TX1_N
MD_PCIE0_2LANES.TX1_P: port PACKET_SWITCH_PCIE_UPSTREAM.TX1_P, sheet U_PCIE_PACKET_SWITCH/PCIE_UPSTREAM.TX1_P
RST_N_1V8: R321.2 ; sheet U_TRANSLATOR_4CH/1V8_A3, port PACKET_SWITCH_PCIE_UPSTREAM.RST_N  [project net GPIO_2]
RST_N_3V3: R329.2 ; sheet U_TRANSLATOR_4CH/3V3_B3, sheet U_PCIE_PACKET_SWITCH/PCIE_UPSTREAM.RST_N
SLEEP_CLK: port WIFI_SUSCLK(32kHz)_1V8, sheet U_WIFI_BLE/SUSCLK(32kHz)_1V8
WAKE_N_1V8: R319.2 ; sheet U_TRANSLATOR_4CH/1V8_A1, port PACKET_SWITCH_PCIE_UPSTREAM.WAKE_N  [project net GPIO_0]
WAKE_N_3V3: R327.2 ; sheet U_TRANSLATOR_4CH/3V3_B1, sheet U_PCIE_PACKET_SWITCH/PCIE_UPSTREAM.WAKE_N
NetJOMEGA_54: port USB1_PWRON1#_3V3, sheet U_PCIE_USB/USB1_PWRON1#_3V3
NetJOMEGA_56: port USB1_OVERCUR1#_3V3, sheet U_PCIE_USB/USB1_OVERCUR1#_3V3
NetJOMEGA_58: port USB3_PWRON1#_3V3, sheet U_PCIE_USB/USB3_PWRON1#_3V3
NetJOMEGA_60: port USB3_OVERCUR1#_3V3, sheet U_PCIE_USB/USB3_OVERCUR1#_3V3
NetR154_2: port USB4_PWRON1#_3V3, sheet U_PCIE_USB/USB4_PWRON1#_3V3
NetR182_2: port USB2_PWRON1#_3V3, sheet U_PCIE_USB/USB2_PWRON1#_3V3
NetR315_2: R315.2 ; sheet U_TRANSLATOR_4CH/1V8_A4
NetR323_2: R323.2 ; sheet U_TRANSLATOR_4CH/3V3_B4
NetU24_A37: port USB2_OVERCUR1#_3V3, sheet U_PCIE_USB/USB2_OVERCUR1#_3V3
NetU24_B45: port USB4_OVERCUR1#_3V3, sheet U_PCIE_USB/USB4_OVERCUR1#_3V3

### Buses and harness runs
harness port I2C_3V3 = sheet U_PCIE_PACKET_SWITCH/I2C_3V3 = sheet U_PCIE_USB/I2C_3V3
harness port NVME_I2C_1V8 = sheet U_PCIE_NVME/I2C_1V8
harness port NVME_PCIE = sheet U_PCIE_NVME/PCIE_4LANES
harness port USB1_DOWN = sheet U_PCIE_USB/USB1_DOWN
harness port USB2_DOWN = sheet U_PCIE_USB/USB2_DOWN
harness port USB3_DOWN = sheet U_PCIE_USB/USB3_DOWN
harness port USB4_DOWN = sheet U_PCIE_USB/USB4_DOWN
harness port WIFI_I2S_1V8 = sheet U_WIFI_BLE/I2S_1V8
harness port WIFI_UART_1V8 = sheet U_WIFI_BLE/UART_1V8
harness sheet U_PCIE_PACKET_SWITCH/PCIE1_DOWNSTREAM = sheet U_WIFI_BLE/PCIE_1LANE
harness sheet U_PCIE_PACKET_SWITCH/PCIE2_DOWNSTREAM = sheet U_PCIE_USB/PCIE_1LANE_UP

### Notes on the sheet
- Title:
- ID:
- Date:
- Time:
- Version:
- Sheet
- of
- RevAuthor:
- Reference Designs ARE PROVIDED "AS IS" AND "WITH ALL FAULTS. Arduino SA DISCLAIMS ALL OTHER WARRANTIES, EXPRESS OR IMPLIED, REGARDING PRODUCTS, INCLUDING BUT NOT LIMITED TO, ANY IMPLIED WARRANTIES OF MERCHANTABILITY OR FITNESS FOR A PARTICULAR PURPOSE.
  Arduino SA may make changes to specifications and product descriptions at any time, without notice. The Customer must not rely on the absence or characteristics of any features or instructions marked "reserved" or "undefined".
  Arduino SA reserves these for future definition and shall have no responsibility whatsoever for conflicts or incompatibilities arising from future changes to them. The product information on the Web Site or Materials is subject to change without notice.
  Do not finalize a design with this info. ARDUINO and other Arduino brands and logos and Trademarks of Arduino SA. All Arduino SA Trademarks cannot be used without owner's formal permission.
- File:
- Author:

### Library data of the parts
R315 R323 R327-R329 R468 = R0145-A.21: as R317 on sheet HEADERS_JCTL; Manufacturer 2: Samsung Electro-Mechanics; Tolerance: 1%; Case Code (Imperial): 0201; Part Number: RC0201FR-0710KL; Technology: Thick film
R319-R322 = R0195-A.22: as R166 on sheet HEADERS_JCTL; Tolerance: 1%; Case Code (Imperial): 0201; Part Number: RC0201FR-071KL; Technology: Thick film

## Sheet PCIE_PACKET_SWITCH.SchDoc: PCIE PACKET SWITCH
size A3; Author: Silvio Navaretti; CompanyName: ARDUINO; DrawnBy: Silvio Navaretti; Engineer: Silvio Navaretti; Organization: ARDUINO; SheetNumber: 25; SheetTotal: 51; RevAuthor: Silvio Navaretti
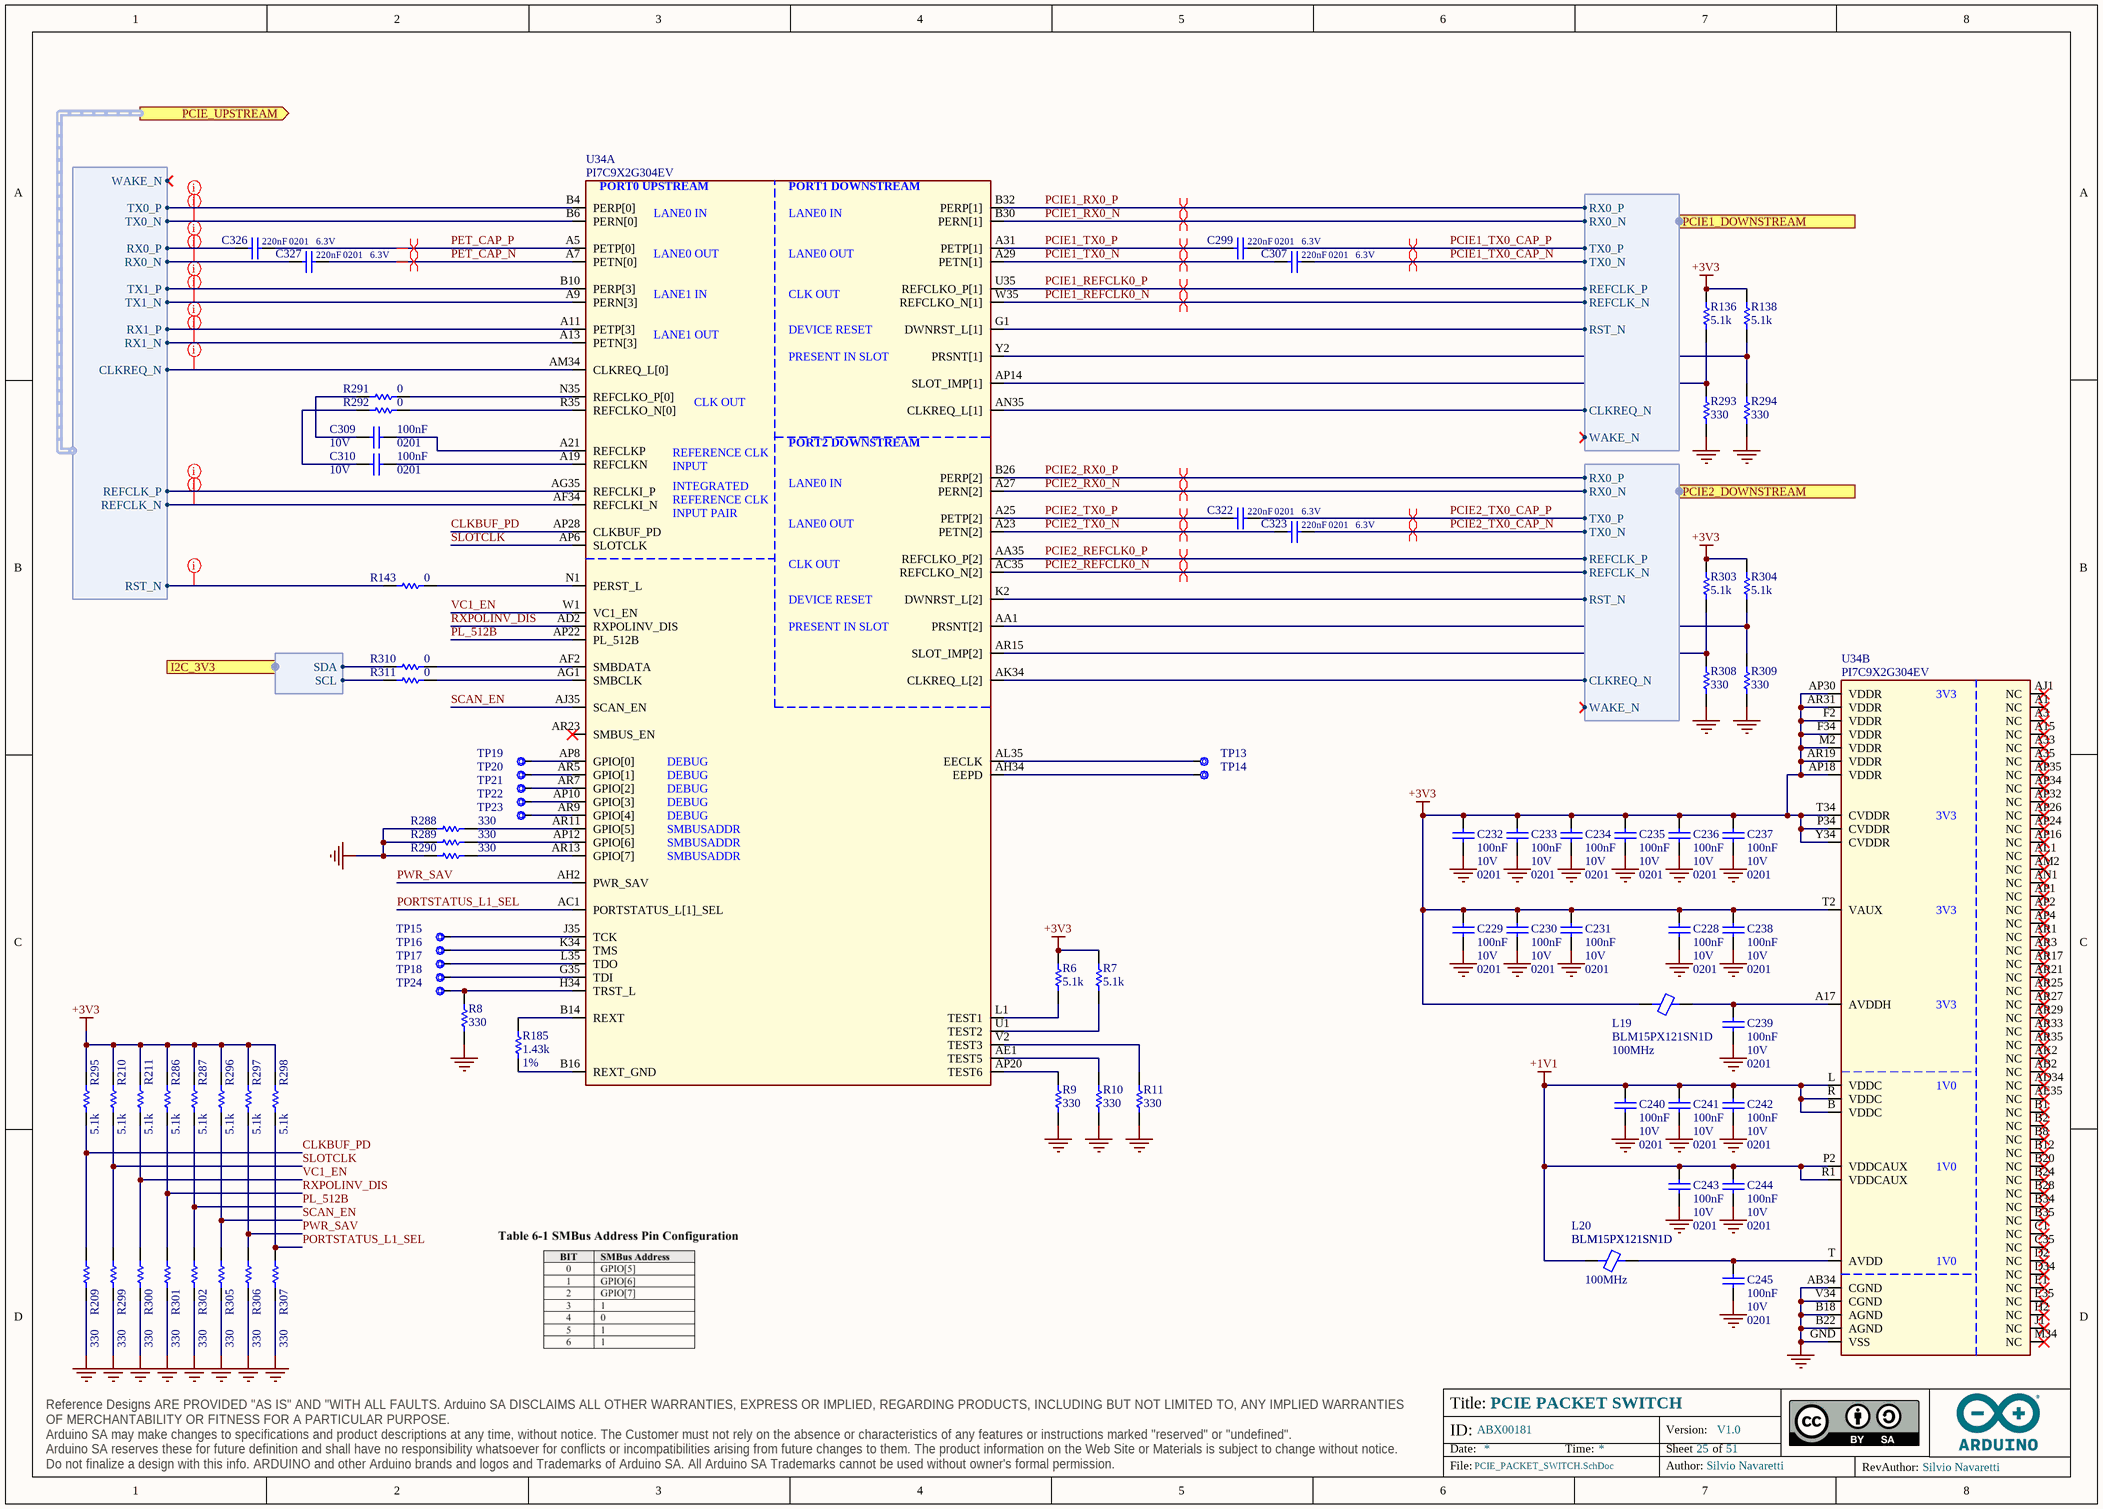
[diagram p47: PCIE_PACKET_SWITCH.SchDoc]

### Parts
C228  value 100nF  Voltage: 10V  Case Code (Imperial): 0201  [CAP-0201]  (hidden comment: CL03A104KP3NNNC)
C229  value 100nF  Voltage: 10V  Case Code (Imperial): 0201  [CAP-0201]  (hidden comment: CL03A104KP3NNNC)
C230  value 100nF  Voltage: 10V  Case Code (Imperial): 0201  [CAP-0201]  (hidden comment: CL03A104KP3NNNC)
C231  value 100nF  Voltage: 10V  Case Code (Imperial): 0201  [CAP-0201]  (hidden comment: CL03A104KP3NNNC)
C232  value 100nF  Voltage: 10V  Case Code (Imperial): 0201  [CAP-0201]  (hidden comment: CL03A104KP3NNNC)
C233  value 100nF  Voltage: 10V  Case Code (Imperial): 0201  [CAP-0201]  (hidden comment: CL03A104KP3NNNC)
C234  value 100nF  Voltage: 10V  Case Code (Imperial): 0201  [CAP-0201]  (hidden comment: CL03A104KP3NNNC)
C235  value 100nF  Voltage: 10V  Case Code (Imperial): 0201  [CAP-0201]  (hidden comment: CL03A104KP3NNNC)
C236  value 100nF  Voltage: 10V  Case Code (Imperial): 0201  [CAP-0201]  (hidden comment: CL03A104KP3NNNC)
C237  value 100nF  Voltage: 10V  Case Code (Imperial): 0201  [CAP-0201]  (hidden comment: CL03A104KP3NNNC)
C238  value 100nF  Voltage: 10V  Case Code (Imperial): 0201  [CAP-0201]  (hidden comment: CL03A104KP3NNNC)
C239  value 100nF  Voltage: 10V  Case Code (Imperial): 0201  [CAP-0201]  (hidden comment: CL03A104KP3NNNC)
C240  value 100nF  Voltage: 10V  Case Code (Imperial): 0201  [CAP-0201]  (hidden comment: CL03A104KP3NNNC)
C241  value 100nF  Voltage: 10V  Case Code (Imperial): 0201  [CAP-0201]  (hidden comment: CL03A104KP3NNNC)
C242  value 100nF  Voltage: 10V  Case Code (Imperial): 0201  [CAP-0201]  (hidden comment: CL03A104KP3NNNC)
C243  value 100nF  Voltage: 10V  Case Code (Imperial): 0201  [CAP-0201]  (hidden comment: CL03A104KP3NNNC)
C244  value 100nF  Voltage: 10V  Case Code (Imperial): 0201  [CAP-0201]  (hidden comment: CL03A104KP3NNNC)
C245  value 100nF  Voltage: 10V  Case Code (Imperial): 0201  [CAP-0201]  (hidden comment: CL03A104KP3NNNC)
C299  value 220nF  Case Code (Imperial): 0201  Voltage: 6.3V  [CAP-0201]  (hidden comment: GRM033R60J224ME15D)
C307  value 220nF  Case Code (Imperial): 0201  Voltage: 6.3V  [CAP-0201]  (hidden comment: GRM033R60J224ME15D)
C309  value 100nF  Voltage: 10V  Case Code (Imperial): 0201  [CAP-0201]  (hidden comment: CL03A104KP3NNNC)
C310  value 100nF  Voltage: 10V  Case Code (Imperial): 0201  [CAP-0201]  (hidden comment: CL03A104KP3NNNC)
C322  value 220nF  Case Code (Imperial): 0201  Voltage: 6.3V  [CAP-0201]  (hidden comment: GRM033R60J224ME15D)
C323  value 220nF  Case Code (Imperial): 0201  Voltage: 6.3V  [CAP-0201]  (hidden comment: GRM033R60J224ME15D)
C326  value 220nF  Case Code (Imperial): 0201  Voltage: 6.3V  [CAP-0201]  (hidden comment: GRM033R60J224ME15D)
C327  value 220nF  Case Code (Imperial): 0201  Voltage: 6.3V  [CAP-0201]  (hidden comment: GRM033R60J224ME15D)
L19  BLM15PX121SN1D  Test Frequency: 100MHz  [L-0402]
L20  BLM15PX121SN1D  Test Frequency: 100MHz  [L-0402]
R6  value 5.1k  [RES-0201]  (hidden comment: ERJ-1GNF5101C)
R7  value 5.1k  [RES-0201]  (hidden comment: ERJ-1GNF5101C)
R8  value 330  [RES-0201]  (hidden comment: AC0201FR-07330RL)
R9  value 330  [RES-0201]  (hidden comment: AC0201FR-07330RL)
R10  value 330  [RES-0201]  (hidden comment: AC0201FR-07330RL)
R11  value 330  [RES-0201]  (hidden comment: AC0201FR-07330RL)
R136  value 5.1k  [RES-0201]  (hidden comment: ERJ-1GNF5101C)
R138  value 5.1k  [RES-0201]  (hidden comment: ERJ-1GNF5101C)
R143  value 0  [RES-0201]  (hidden comment: CRCW02010000Z0ED)
R185  value 1.43k  Tolerance: 1%  [RES-0201]  (hidden comment: RC0201FR-071K43L)
R209  value 330  [RES-0201]  (hidden comment: AC0201FR-07330RL)
R210  value 5.1k  [RES-0201]  (hidden comment: ERJ-1GNF5101C)
R211  value 5.1k  [RES-0201]  (hidden comment: ERJ-1GNF5101C)
R286  value 5.1k  [RES-0201]  (hidden comment: ERJ-1GNF5101C)
R287  value 5.1k  [RES-0201]  (hidden comment: ERJ-1GNF5101C)
R288  value 330  [RES-0201]  (hidden comment: AC0201FR-07330RL)
R289  value 330  [RES-0201]  (hidden comment: AC0201FR-07330RL)
R290  value 330  [RES-0201]  (hidden comment: AC0201FR-07330RL)
R291  value 0  [RES-0201]  (hidden comment: CRCW02010000Z0ED)
R292  value 0  [RES-0201]  (hidden comment: CRCW02010000Z0ED)
R293  value 330  [RES-0201]  (hidden comment: AC0201FR-07330RL)
R294  value 330  [RES-0201]  (hidden comment: AC0201FR-07330RL)
R295  value 5.1k  [RES-0201]  (hidden comment: ERJ-1GNF5101C)
R296  value 5.1k  [RES-0201]  (hidden comment: ERJ-1GNF5101C)
R297  value 5.1k  [RES-0201]  (hidden comment: ERJ-1GNF5101C)
R298  value 5.1k  [RES-0201]  (hidden comment: ERJ-1GNF5101C)
R299  value 330  [RES-0201]  (hidden comment: AC0201FR-07330RL)
R300  value 330  [RES-0201]  (hidden comment: AC0201FR-07330RL)
R301  value 330  [RES-0201]  (hidden comment: AC0201FR-07330RL)
R302  value 330  [RES-0201]  (hidden comment: AC0201FR-07330RL)
R303  value 5.1k  [RES-0201]  (hidden comment: ERJ-1GNF5101C)
R304  value 5.1k  [RES-0201]  (hidden comment: ERJ-1GNF5101C)
R305  value 330  [RES-0201]  (hidden comment: AC0201FR-07330RL)
R306  value 330  [RES-0201]  (hidden comment: AC0201FR-07330RL)
R307  value 330  [RES-0201]  (hidden comment: AC0201FR-07330RL)
R308  value 330  [RES-0201]  (hidden comment: AC0201FR-07330RL)
R309  value 330  [RES-0201]  (hidden comment: AC0201FR-07330RL)
R310  value 0  [RES-0201]  (hidden comment: CRCW02010000Z0ED)
R311  value 0  [RES-0201]  (hidden comment: CRCW02010000Z0ED)
TP13  Test point 1.00mm  [TP-1.00MM]  (value not drawn)  (no BOM)
TP14  Test point 1.00mm  [TP-1.00MM]  (value not drawn)  (no BOM)
TP15  Test point 1.00mm  [TP-1.00MM]  (value not drawn)  (no BOM)
TP16  Test point 1.00mm  [TP-1.00MM]  (value not drawn)  (no BOM)
TP17  Test point 1.00mm  [TP-1.00MM]  (value not drawn)  (no BOM)
TP18  Test point 1.00mm  [TP-1.00MM]  (value not drawn)  (no BOM)
TP19  Test point 1.00mm  [TP-1.00MM]  (value not drawn)  (no BOM)
TP20  Test point 1.00mm  [TP-1.00MM]  (value not drawn)  (no BOM)
TP21  Test point 1.00mm  [TP-1.00MM]  (value not drawn)  (no BOM)
TP22  Test point 1.00mm  [TP-1.00MM]  (value not drawn)  (no BOM)
TP23  Test point 1.00mm  [TP-1.00MM]  (value not drawn)  (no BOM)
TP24  Test point 1.00mm  [TP-1.00MM]  (value not drawn)  (no BOM)
U34  PI7C9X2G304EV  [PI7C9X2G304EV-Footprint-1]  (parts A,B of 2)

### Ports
I2C_3V3 (out, harness I2C), PCIE1_DOWNSTREAM (out, harness PCIE_1LANE), PCIE2_DOWNSTREAM (out, harness PCIE_1LANE), PCIE_UPSTREAM (out, harness SOM_MD_PCIE0)

### Harnesses
PCIE_1LANE: RX0_N, RX0_P, TX0_P, TX0_N, REFCLK_N, REFCLK_P, WAKE_N, CLKREQ_N, RST_N
I2C: SDA, SCL
SOM_MD_PCIE0: RX0_N, RX0_P, TX0_P, TX0_N, RX1_N, RX1_P, TX1_P, TX1_N, REFCLK_N, REFCLK_P, WAKE_N, CLKREQ_N, RST_N

### Nets
+1V1: C240.2 C241.2 C242.2 C243.2 C244.2 L20.1 U34.B(VDDC) U34.L(VDDC) U34.P2(VDDCAUX) U34.R(VDDC) U34.R1(VDDCAUX)
+3V3: C228.2 C229.2 C230.2 C231.2 C232.2 C233.2 C234.2 C235.2 C236.2 C237.2 C238.2 L19.1 R6.2 R7.2 R136.2 R138.2 R210.2 R211.2 R286.2 R287.2 R295.2 R296.2 R297.2 R298.2 R303.2 R304.2 U34.AP18(VDDR) U34.AP30(VDDR) U34.AR19(VDDR) U34.AR31(VDDR) U34.F2(VDDR) U34.F34(VDDR) U34.M2(VDDR) U34.P34(CVDDR) U34.T2(VAUX) U34.T34(CVDDR) U34.Y34(CVDDR)
GND: C228.1 C229.1 C230.1 C231.1 C232.1 C233.1 C234.1 C235.1 C236.1 C237.1 C238.1 C239.1 C240.1 C241.1 C242.1 C243.1 C244.1 C245.1 R8.1 R9.1 R10.1 R11.1 R209.1 R288.2 R289.2 R290.2 R293.1 R294.1 R299.1 R300.1 R301.1 R302.1 R305.1 R306.1 R307.1 R308.1 R309.1 U34.AB34(CGND) U34.B18(AGND) U34.B22(AGND) U34.GND(VSS) U34.V34(CGND)
CLKBUF_PD: R209.2 R295.1 U34.AP28(CLKBUF_PD)  [project net CLKBUF_PD_25]
CLKREQ_N_3V3: U34.AM34(CLKREQ_L[0]) ; port PCIE_UPSTREAM.CLKREQ_N
MD_PCIE0_2LANES.REFCLK_N: U34.AF34(REFCLKI_N) ; port PCIE_UPSTREAM.REFCLK_N
MD_PCIE0_2LANES.REFCLK_P: U34.AG35(REFCLKI_P) ; port PCIE_UPSTREAM.REFCLK_P
MD_PCIE0_2LANES.RX0_N: C327.2 ; port PCIE_UPSTREAM.RX0_N
MD_PCIE0_2LANES.RX0_P: C326.2 ; port PCIE_UPSTREAM.RX0_P
MD_PCIE0_2LANES.RX1_N: U34.A13(PETN[3]) ; port PCIE_UPSTREAM.RX1_N
MD_PCIE0_2LANES.RX1_P: U34.A11(PETP[3]) ; port PCIE_UPSTREAM.RX1_P
MD_PCIE0_2LANES.TX0_N: U34.B6(PERN[0]) ; port PCIE_UPSTREAM.TX0_N
MD_PCIE0_2LANES.TX0_P: U34.B4(PERP[0]) ; port PCIE_UPSTREAM.TX0_P
MD_PCIE0_2LANES.TX1_N: U34.A9(PERN[3]) ; port PCIE_UPSTREAM.TX1_N
MD_PCIE0_2LANES.TX1_P: U34.B10(PERP[3]) ; port PCIE_UPSTREAM.TX1_P
MD_QUP1_SE4_I2C_3V3.SCL: R311.2 ; port I2C_3V3.SCL
MD_QUP1_SE4_I2C_3V3.SDA: R310.2 ; port I2C_3V3.SDA
PCIE1_REFCLK0_N: U34.W35(REFCLKO_N[1]) ; port PCIE1_DOWNSTREAM.REFCLK_N
PCIE1_REFCLK0_P: U34.U35(REFCLKO_P[1]) ; port PCIE1_DOWNSTREAM.REFCLK_P
PCIE1_RX0_N: U34.B30(PERN[1]) ; port PCIE1_DOWNSTREAM.RX0_N
PCIE1_RX0_P: U34.B32(PERP[1]) ; port PCIE1_DOWNSTREAM.RX0_P
PCIE1_TX0_CAP_N: C307.1 ; port PCIE1_DOWNSTREAM.TX0_N
PCIE1_TX0_CAP_P: C299.1 ; port PCIE1_DOWNSTREAM.TX0_P
PCIE1_TX0_N: C307.2 U34.A29(PETN[1])  [project net PCIE1_TX0_N_25]
PCIE1_TX0_P: C299.2 U34.A31(PETP[1])  [project net PCIE1_TX0_P_25]
PCIE2_REFCLK0_N: U34.AC35(REFCLKO_N[2]) ; port PCIE2_DOWNSTREAM.REFCLK_N
PCIE2_REFCLK0_P: U34.AA35(REFCLKO_P[2]) ; port PCIE2_DOWNSTREAM.REFCLK_P
PCIE2_RX0_N: U34.A27(PERN[2]) ; port PCIE2_DOWNSTREAM.RX0_N
PCIE2_RX0_P: U34.B26(PERP[2]) ; port PCIE2_DOWNSTREAM.RX0_P
PCIE2_TX0_CAP_N: C323.1 ; port PCIE2_DOWNSTREAM.TX0_N
PCIE2_TX0_CAP_P: C322.1 ; port PCIE2_DOWNSTREAM.TX0_P
PCIE2_TX0_N: C323.2 U34.A23(PETN[2])  [project net PCIE2_TX0_N_25]
PCIE2_TX0_P: C322.2 U34.A25(PETP[2])  [project net PCIE2_TX0_P_25]
PET_CAP_N: C327.1 U34.A7(PETN[0])  [project net PET_CAP_N_25]
PET_CAP_P: C326.1 U34.A5(PETP[0])  [project net PET_CAP_P_25]
PL_512B: R287.1 R302.2 U34.AP22(PL_512B)  [project net PL_512B_25]
PORTSTATUS_L1_SEL: R298.1 R307.2 U34.AC1(PORTSTATUS_L[1]_SEL)  [project net PORTSTATUS_L1_SEL_25]
PWR_SAV: R297.1 R306.2 U34.AH2(PWR_SAV)  [project net PWR_SAV_25]
RST_N_3V3: R143.2 ; port PCIE_UPSTREAM.RST_N
RXPOLINV_DIS: R286.1 R301.2 U34.AD2(RXPOLINV_DIS)  [project net RXPOLINV_DIS_25]
SCAN_EN: R296.1 R305.2 U34.AJ35(SCAN_EN)  [project net SCAN_EN_25]
SLOTCLK: R210.1 R299.2 U34.AP6(SLOTCLK)  [project net SLOTCLK_25]
VC1_EN: R211.1 R300.2 U34.W1(VC1_EN)  [project net VC1_EN_25]
NetC239_2: C239.2 L19.2 U34.A17(AVDDH)
NetC245_2: C245.2 L20.2 U34.T(AVDD)
NetC309_1: C309.1 U34.A21(REFCLKP)
NetC309_2: C309.2 R291.1
NetC310_1: C310.1 U34.A19(REFCLKN)
NetC310_2: C310.2 R292.1
NetR6_1: R6.1 U34.L1(TEST1)
NetR7_1: R7.1 U34.U1(TEST2)
NetR8_2: R8.2 TP24.X U34.H34(TRST_L)
NetR9_2: R9.2 U34.AP20(TEST6)
NetR10_2: R10.2 U34.AE1(TEST5)
NetR11_2: R11.2 U34.V2(TEST3)
NetR136_1: R136.1 R293.2 U34.AP14(SLOT_IMP[1])
NetR138_1: R138.1 R294.2 U34.Y2(PRSNT[1])
NetR143_1: R143.1 U34.N1(PERST_L)
NetR185_1: R185.1 U34.B14(REXT)
NetR185_2: R185.2 U34.B16(REXT_GND)
NetR288_1: R288.1 U34.AR11(GPIO[5])
NetR289_1: R289.1 U34.AP12(GPIO[6])
NetR290_1: R290.1 U34.AR13(GPIO[7])
NetR291_2: R291.2 U34.N35(REFCLKO_P[0])
NetR292_2: R292.2 U34.R35(REFCLKO_N[0])
NetR303_1: R303.1 R308.2 U34.AR15(SLOT_IMP[2])
NetR304_1: R304.1 R309.2 U34.AA1(PRSNT[2])
NetR310_1: R310.1 U34.AF2(SMBDATA)
NetR311_1: R311.1 U34.AG1(SMBCLK)
NetR463_2: U34.AN35(CLKREQ_L[1]) ; port PCIE1_DOWNSTREAM.CLKREQ_N
NetR464_2: U34.G1(DWNRST_L[1]) ; port PCIE1_DOWNSTREAM.RST_N
NetTP13_X: TP13.X U34.AL35(EECLK)
NetTP14_X: TP14.X U34.AH34(EEPD)
NetTP15_X: TP15.X U34.J35(TCK)
NetTP16_X: TP16.X U34.K34(TMS)
NetTP17_X: TP17.X U34.L35(TDO)
NetTP18_X: TP18.X U34.G35(TDI)
NetTP19_X: TP19.X U34.AP8(GPIO[0])
NetTP20_X: TP20.X U34.AR5(GPIO[1])
NetTP21_X: TP21.X U34.AR7(GPIO[2])
NetTP22_X: TP22.X U34.AP10(GPIO[3])
NetTP23_X: TP23.X U34.AR9(GPIO[4])
NetU24_A40: U34.K2(DWNRST_L[2]) ; port PCIE2_DOWNSTREAM.RST_N
NetU24_B36: U34.AK34(CLKREQ_L[2]) ; port PCIE2_DOWNSTREAM.CLKREQ_N

Not connected (* = marked no-connect by the designer): U34 A1(NC)* A3(NC)* A15(NC)* A33(NC)* A35(NC)* AB2(NC)* AD34(NC)* AE35(NC)* AJ1(NC)* AK2(NC)* AL1(NC)* AM2(NC)* AN1(NC)* AP1(NC)* AP2(NC)* AP4(NC)* AP16(NC)* AP24(NC)* AP26(NC)* AP32(NC)* AP34(NC)* AP35(NC)* AR1(NC)* AR3(NC)* AR17(NC)* AR21(NC)* AR23(SMBUS_EN)* AR25(NC)* AR27(NC)* AR29(NC)* AR33(NC)* AR35(NC)* B1(NC)* B2(NC)* B8(NC)* B12(NC)* B20(NC)* B24(NC)* B28(NC)* B34(NC)* B35(NC)* C1(NC)* C35(NC)* D2(NC)* D34(NC)* E1(NC)* E35(NC)* H2(NC)* J1(NC)* M34(NC)*

### Layout directives
differential pair; differential pair class DIFF_PCIE_DOWN1: PCIE1_REFCLK0_N, PCIE1_REFCLK0_P, PCIE1_RX0_N, PCIE1_RX0_P, PCIE1_TX0_CAP_N, PCIE1_TX0_CAP_P, PCIE1_TX0_N_25, PCIE1_TX0_P_25
net class NET_PCIE_UP: CLKREQ_N_3V3, MD_PCIE0_2LANES.REFCLK_N, MD_PCIE0_2LANES.REFCLK_P, MD_PCIE0_2LANES.RX0_N, MD_PCIE0_2LANES.RX0_P, MD_PCIE0_2LANES.RX1_N, MD_PCIE0_2LANES.RX1_P, MD_PCIE0_2LANES.TX0_N, MD_PCIE0_2LANES.TX0_P, MD_PCIE0_2LANES.TX1_N, MD_PCIE0_2LANES.TX1_P, RST_N_3V3
differential pair; differential pair class DIFF_PCIE_DOWN2: PCIE2_REFCLK0_N, PCIE2_REFCLK0_P, PCIE2_RX0_N, PCIE2_RX0_P, PCIE2_TX0_CAP_N, PCIE2_TX0_CAP_P, PCIE2_TX0_N_25, PCIE2_TX0_P_25
differential pair; differential pair class DIFF_PCIE_PET: PET_CAP_N_25, PET_CAP_P_25

### Notes on the sheet
- Title:
- ID:
- Date:
- Time:
- Version:
- Sheet
- of
- RevAuthor:
- Reference Designs ARE PROVIDED "AS IS" AND "WITH ALL FAULTS. Arduino SA DISCLAIMS ALL OTHER WARRANTIES, EXPRESS OR IMPLIED, REGARDING PRODUCTS, INCLUDING BUT NOT LIMITED TO, ANY IMPLIED WARRANTIES OF MERCHANTABILITY OR FITNESS FOR A PARTICULAR PURPOSE.
  Arduino SA may make changes to specifications and product descriptions at any time, without notice. The Customer must not rely on the absence or characteristics of any features or instructions marked "reserved" or "undefined".
  Arduino SA reserves these for future definition and shall have no responsibility whatsoever for conflicts or incompatibilities arising from future changes to them. The product information on the Web Site or Materials is subject to change without notice.
  Do not finalize a design with this info. ARDUINO and other Arduino brands and logos and Trademarks of Arduino SA. All Arduino SA Trademarks cannot be used without owner's formal permission.
- File:
- Author:
- (in symbol U0511-A.14, part A) PORT0 UPSTREAM; PORT1 DOWNSTREAM; LANE0 IN; LANE0 OUT; LANE1 IN; CLK OUT; DEVICE RESET; LANE1 OUT; PRESENT IN SLOT; PORT2 DOWNSTREAM; REFERENCE CLK / INPUT; INTEGRATED REFERENCE CLK INPUT PAIR; DEBUG; SMBUSADDR
- (in symbol U0511-A.14, part B) 3V3; 1V0

### Library data of the parts
C228-C245 C309 C310 = C0113-A.6: as C305 on sheet HEATSINK_FAN; Technology: Ceramic; Part Number: CL03A104KP3NNNC; Dielectric: X5R; Tolerance: 10%
C299 C307 C322 C323 C326 C327 = C0004-A.15: CAP CHIP 0201 220nF 20% 6.3V X5R; Manufacturer: Murata; Code Arduino: C0004; Technology: Ceramic; Tolerance: 20%; Part Number: GRM033R60J224ME15D; Dielectric: X5R
L19 L20 = I0028-A.10: FERRITE SMD 0402 120Ohm 25% 100MHz Ferrite 2A; Manufacturer: Murata; Inductance: 120µH; DC Resistance (DCR): 55mR; Code Arduino: I0028; Value: 120µH; Device Type: Ferrite; Packaging: Tape and Reel; Case Code (Imperial): 0402; Max DC Current: 2A; Case Code (Metric): 1005; Package Quantity: 10000; Current: 2A; Max Operating Temperature: 125°C; Tolerance: 25%; Min Operating Temperature: -55°C
  L20: Part Number: BLM15PX121SN1D
R6 R7 R136 R138 R210 R211 R286 R287 R295-R298 R303 R304 = R0376-A.1: RES CHIP 0201 5k1 1% 1/20W; Manufacturer: Panasonic; Code Arduino: R0376; Power: 50mW; Temperature Coefficient: 200ppm; Technology: Thick film; Part Number: ERJ-1GNF5101C; Case Code (Imperial): 0201; Tolerance: 1%
R8-R11 R209 R288-R290 R293 R294 R299-R302 R305-R309 = R0149-A.21: RES CHIP 0201 330R 1% 1/20W; Manufacturer: Yageo; Code Arduino: R0149; Power: 50mW; Temperature coefficient: 200ppm; Case Code (Imperial): 0201; Technology: Thick film; Part Number: AC0201FR-07330RL; Manufacturer 2: Samsung Electro-Mechanics; Tolerance: 1%
R143 R291 R292 R310 R311 = R0140-A.21: as R508 on sheet HEADERS_JMEDIA_JMISC; Technology: Thick film; Case Code (Imperial): 0201; Part Number: CRCW02010000Z0ED
R185 = R0400-A.1: RES CHIP 0201 1k43 1% 1/20W; Manufacturer: YAGEO; Power: 50mW; Temperature Coefficient: 200ppm; Code Arduino: R0400; Technology: Thick film; Case Code (Imperial): 0201; Part Number: RC0201FR-071K43L
TP13-TP24 = UT0013-A.6: Part Number: This is not a component; Design Item ID: CMP-018-0005-A.3; Source: ut.SchLib; Manufacturer: This is not a component; Code Arduino: This is not a component; Pin Count: 1
U34 = U0511-A.14: IC 3PCIe 2.0 Packet Switch 3-Port, 4-Lane aQFN136 10x10mm; Manufacturer: Diodes Incorporated; Code Arduino: U0511; Part Number: PI7C9X2G304EV